# EAGLE design NB-IoT-ideaboard-v2.0 (EAGLE 8.7.1)

## Sheet 1 of 4
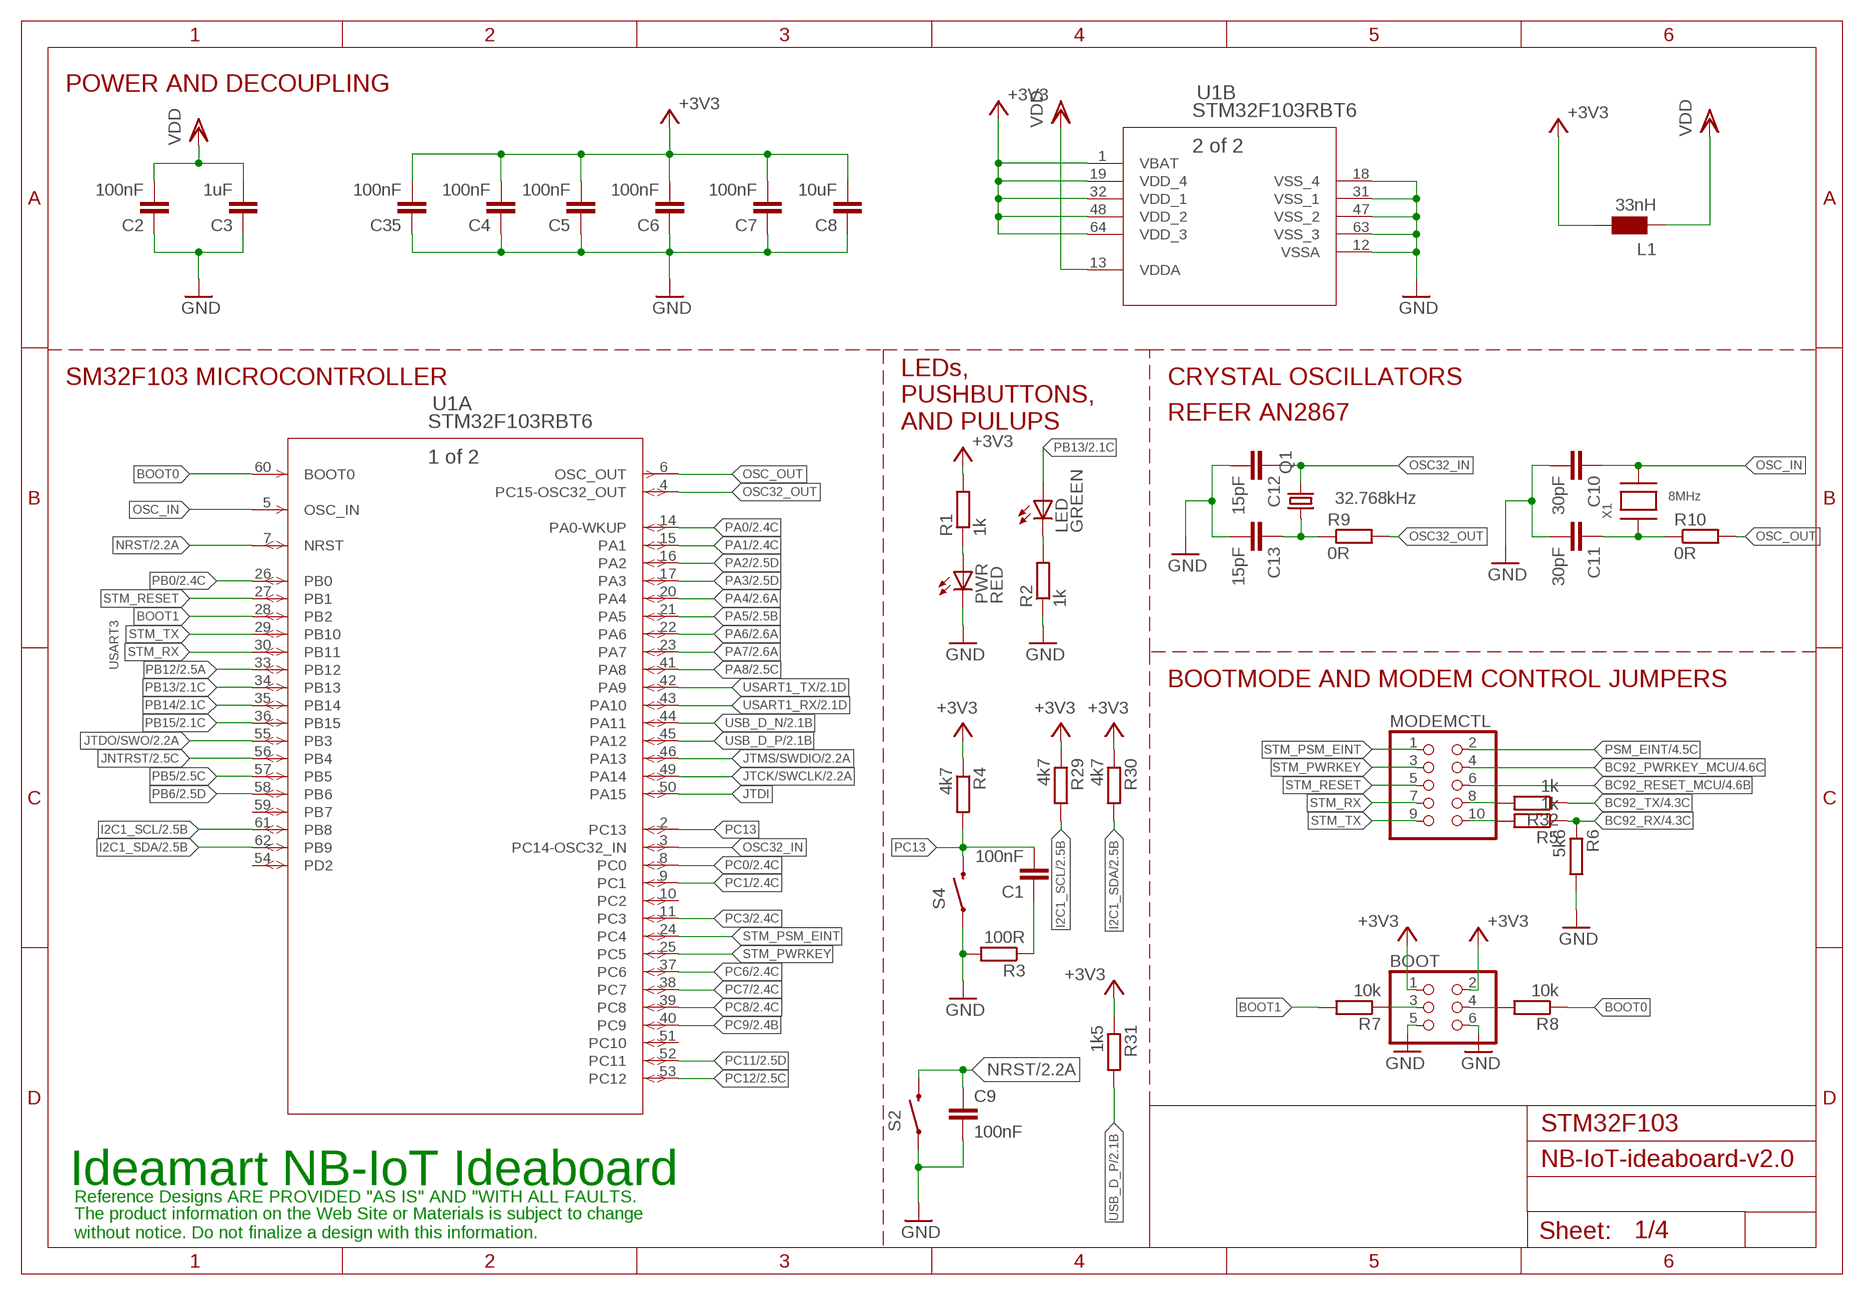
[diagram p0: schematic, sheet 1]

### Parts
BOOT  PINHD-2X03_2.54  [2X03]
C1  100nF  C-EUC0805  [C0805]
C2  100nF  C-EUC0805  [C0805]
C3  1uF  C-EUC0805  [C0805]
C4  100nF  C-EUC0805  [C0805]
C5  100nF  C-EUC0805  [C0805]
C6  100nF  C-EUC0805  [C0805]
C7  100nF  C-EUC0805  [C0805]
C8  10uF  C-EUC1206  [C1206]
C9  100nF  C-EUC0805  [C0805]
C10  30pF  C-EUC0805  [C0805]
C11  30pF  C-EUC0805  [C0805]
C12  15pF  C-EUC0805  [C0805]
C13  15pF  C-EUC0805  [C0805]
C35  100nF  C-EUC0805  [C0805]
L1  33nH  WE-CBF_0603  [0603]
LED  GREEN  LEDCHIP-LED0805  [CHIP-LED0805]
MODEMCTL  PINHD-2X05_2.54  [2X05]
PWR  RED  LEDCHIP-LED0805  [CHIP-LED0805]
Q1  32.768kHz  KX-327-NHT  [3.2X1.5]
R1  1k  R-EU_R0805  [R0805]
R2  1k  R-EU_R0805  [R0805]
R3  100R  R-EU_R0805  [R0805]
R4  4k7  R-EU_R0805  [R0805]
R5  1k  R-EU_R0805  [R0805]
R6  5k6  R-EU_R0805  [R0805]
R7  10k  R-EU_R0805  [R0805]
R8  10k  R-EU_R0805  [R0805]
R9  0R  R-EU_R0805  [R0805]
R10  0R  R-EU_R0805  [R0805]
R29  4k7  R-EU_R0805  [R0805]
R30  4k7  R-EU_R0805  [R0805]
R31  1k5  R-EU_R0805  [R0805]
R32  1k  R-EU_R0805  [R0805]
S2  SWITCH-MOMENTARY-2SMD  [TACTILE-SWITCH-SMD]
S4  SWITCH-MOMENTARY-2SMD  [TACTILE-SWITCH-SMD]
U1  STM32F103RBT6  [LQFP64-10X10MM]
X1  8MHz  XTALNX5032  [NX5032]

### Nets
+3V3: BOOT.1 BOOT.2 C4.2 C5.2 C6.2 C7.2 C8.2 C35.2 L1.2 R1.2 R4.1 R29.1 R30.1 R31.1 U1.1(B:VBAT) U1.19(B:VDD_4) U1.32(B:VDD_1) U1.48(B:VDD_2) U1.64(B:VDD_3) ; also sheet 2,3
BC92_PWRKEY_MCU: MODEMCTL.4 ; also sheet 4
BC92_RESET_MCU: MODEMCTL.6 ; also sheet 4
BC92_RX: R5.1 R6.1 ; also sheet 4
BC92_TX: R32.1 ; also sheet 4
BOOT0: R8.1 U1.60(A:BOOT0)
BOOT1: R7.2 U1.28(A:PB2)
GND [gnd]: BOOT.5 BOOT.6 C2.1 C3.1 C4.1 C5.1 C6.1 C7.1 C8.1 C9.2 C10.2 C11.2 C12.2 C13.2 C35.1 PWR.C R2.1 R3.2 R6.2 S2.1 S4.1 U1.12(B:VSSA) U1.18(B:VSS_4) U1.31(B:VSS_1) U1.47(B:VSS_2) U1.63(B:VSS_3) ; also sheet 2,3,4
I2C1_SCL: R29.2 U1.61(A:PB8) ; also sheet 2
I2C1_SDA: R30.2 U1.62(A:PB9) ; also sheet 2
JNTRST: U1.56(A:PB4) ; also sheet 2
JTCK/SWCLK: U1.49(A:PA14) ; also sheet 2
JTDI: U1.50(A:PA15)
JTDO/SWO: U1.55(A:PB3) ; also sheet 2
JTMS/SWDIO: U1.46(A:PA13) ; also sheet 2
N$1: BOOT.3 R7.1
N$3: PWR.A R1.1
N$7: C11.1 R10.1 X1.P$1
N$8: C13.1 Q1.1 R9.1
N$12: MODEMCTL.10 R5.2
N$17: MODEMCTL.8 R32.2
N$19: C1.1 R3.1
N$25: BOOT.4 R8.2
N$26: LED.C R2.2
NRST: C9.1 S2.3 U1.7(A:NRST) ; also sheet 2
OSC32_IN: C12.1 Q1.2 U1.3(A:PC14-OSC32_IN)
OSC32_OUT: R9.2 U1.4(A:PC15-OSC32_OUT)
OSC_IN: C10.1 U1.5(A:OSC_IN) X1.P$2
OSC_OUT: R10.2 U1.6(A:OSC_OUT)
PA0: U1.14(A:PA0-WKUP) ; also sheet 2
PA1: U1.15(A:PA1) ; also sheet 2
PA2: U1.16(A:PA2) ; also sheet 2
PA3: U1.17(A:PA3) ; also sheet 2
PA4: U1.20(A:PA4) ; also sheet 2
PA5: U1.21(A:PA5) ; also sheet 2
PA6: U1.22(A:PA6) ; also sheet 2
PA7: U1.23(A:PA7) ; also sheet 2
PA8: U1.41(A:PA8) ; also sheet 2
PB0: U1.26(A:PB0) ; also sheet 2
PB5: U1.57(A:PB5) ; also sheet 2
PB6: U1.58(A:PB6) ; also sheet 2
PB12: U1.33(A:PB12) ; also sheet 2
PB13: LED.A U1.34(A:PB13) ; also sheet 2
PB14: U1.35(A:PB14) ; also sheet 2
PB15: U1.36(A:PB15) ; also sheet 2
PC0: U1.8(A:PC0) ; also sheet 2
PC1: U1.9(A:PC1) ; also sheet 2
PC3: U1.11(A:PC3) ; also sheet 2
PC6: U1.37(A:PC6) ; also sheet 2
PC7: U1.38(A:PC7) ; also sheet 2
PC8: U1.39(A:PC8) ; also sheet 2
PC9: U1.40(A:PC9) ; also sheet 2
PC11: U1.52(A:PC11) ; also sheet 2
PC12: U1.53(A:PC12) ; also sheet 2
PC13: C1.2 R4.2 S4.3 U1.2(A:PC13)
PSM_EINT: MODEMCTL.2 ; also sheet 4
STM_PSM_EINT: MODEMCTL.1 U1.24(A:PC4)
STM_PWRKEY: MODEMCTL.3 U1.25(A:PC5)
STM_RESET: MODEMCTL.5 U1.27(A:PB1)
STM_RX: MODEMCTL.7 U1.30(A:PB11)
STM_TX: MODEMCTL.9 U1.29(A:PB10)
USART1_RX: U1.43(A:PA10) ; also sheet 2
USART1_TX: U1.42(A:PA9) ; also sheet 2
USB_D_N [usb_diff]: U1.44(A:PA11) ; also sheet 2,3
USB_D_P [usb_diff]: R31.2 U1.45(A:PA12) ; also sheet 2,3
VDD: C2.2 C3.2 L1.1 U1.13(B:VDDA)
Unconnected: U1.10(A:PC2) U1.51(A:PC10) U1.54(A:PD2) U1.59(A:PB7)

### Notes on the sheet
- POWER AND DECOUPLING
- SM32F103 MICROCONTROLLER | CRYSTAL OSCILLATORS
- REFER AN2867
- LEDs,
  PUSHBUTTONS,
  AND PULUPS
- USART3
- BOOTMODE AND MODEM CONTROL JUMPERS
- STM32F103
- Ideamart NB-IoT Ideaboard
- Reference Designs ARE PROVIDED "AS IS" AND "WITH ALL FAULTS.
- The product information on the Web Site or Materials is subject to change
  without notice. Do not finalize a design with this information.

## Sheet 2 of 4
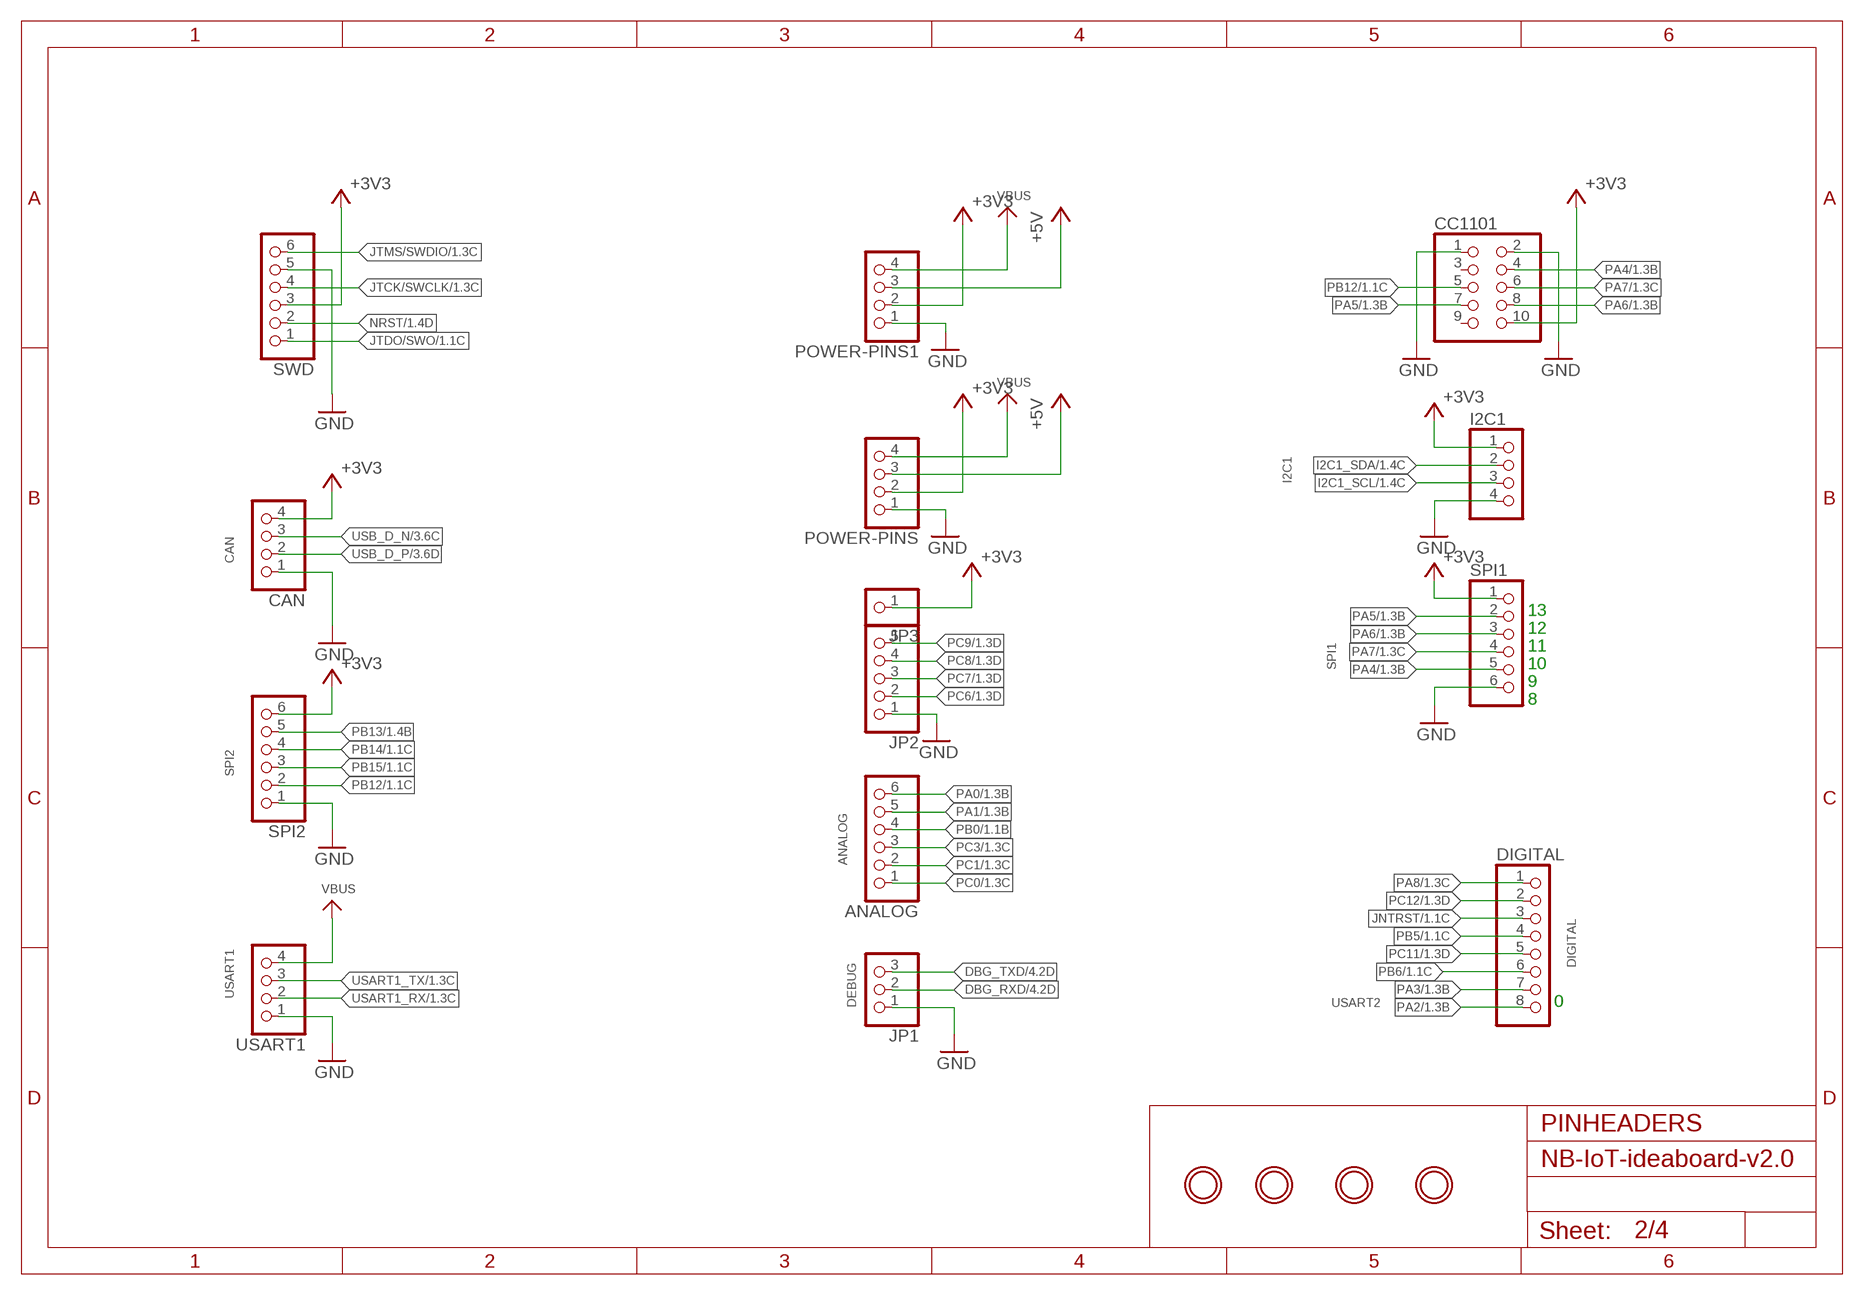
[diagram p1: schematic, sheet 2]

### Parts
$H1  MOUNTINGHOLE3.0THIN  [MOUNTINGHOLE_3.0_PLATEDTHIN]
$H2  MOUNTINGHOLE3.0THIN  [MOUNTINGHOLE_3.0_PLATEDTHIN]
$H3  MOUNTINGHOLE3.0THIN  [MOUNTINGHOLE_3.0_PLATEDTHIN]
$H4  MOUNTINGHOLE3.0THIN  [MOUNTINGHOLE_3.0_PLATEDTHIN]
ANALOG  PINHD-1X06_2.54-S  [1X06-S]
CAN  PINHD-1X04_2.54-S  [1X04-S]
CC1101  PINHD-2X05_2.54  [2X05]
DIGITAL  PINHD-1X08_2.54-S  [1X08-S]
I2C1  PINHD-1X04_2.54-S  [1X04-S]
JP1  PINHD-1X03_2.54-S  [1X03-S]
JP2  PINHD-1X05_2.54-S  [1X05-S]
JP3  PINHD-1X01_2.54-S  [1X01-S]
POWER-PINS  PINHD-1X04_2.54-S  [1X04-S]
POWER-PINS1  PINHD-1X04_2.54-S  [1X04-S]
SPI1  PINHD-1X06_2.54-S  [1X06-S]
SPI2  PINHD-1X06_2.54-S  [1X06-S]
SWD  PINHD-1X06_2.54-S  [1X06-S]
USART1  PINHD-1X04_2.54-S  [1X04-S]

### Nets
+3V3: CAN.4 CC1101.10 I2C1.1 JP3.1 POWER-PINS1.2 POWER-PINS.2 SPI1.1 SPI2.6 SWD.3 ; also sheet 1,3
+5V [usbvcc]: POWER-PINS1.3 POWER-PINS.3 ; also sheet 3
DBG_RXD: JP1.2 ; also sheet 4
DBG_TXD: JP1.3 ; also sheet 4
GND [gnd]: CAN.1 CC1101.1 CC1101.2 I2C1.4 JP1.1 JP2.1 POWER-PINS1.1 POWER-PINS.1 SPI1.6 SPI2.1 SWD.5 USART1.1 ; also sheet 1,3,4
I2C1_SCL: I2C1.3 ; also sheet 1
I2C1_SDA: I2C1.2 ; also sheet 1
JNTRST: DIGITAL.3 ; also sheet 1
JTCK/SWCLK: SWD.4 ; also sheet 1
JTDO/SWO: SWD.1 ; also sheet 1
JTMS/SWDIO: SWD.6 ; also sheet 1
NRST: SWD.2 ; also sheet 1
PA0: ANALOG.6 ; also sheet 1
PA1: ANALOG.5 ; also sheet 1
PA2: DIGITAL.8 ; also sheet 1
PA3: DIGITAL.7 ; also sheet 1
PA4: CC1101.4 SPI1.5 ; also sheet 1
PA5: CC1101.7 SPI1.2 ; also sheet 1
PA6: CC1101.8 SPI1.3 ; also sheet 1
PA7: CC1101.6 SPI1.4 ; also sheet 1
PA8: DIGITAL.1 ; also sheet 1
PB0: ANALOG.4 ; also sheet 1
PB5: DIGITAL.4 ; also sheet 1
PB6: DIGITAL.6 ; also sheet 1
PB12: CC1101.5 SPI2.2 ; also sheet 1
PB13: SPI2.5 ; also sheet 1
PB14: SPI2.4 ; also sheet 1
PB15: SPI2.3 ; also sheet 1
PC0: ANALOG.1 ; also sheet 1
PC1: ANALOG.2 ; also sheet 1
PC3: ANALOG.3 ; also sheet 1
PC6: JP2.2 ; also sheet 1
PC7: JP2.3 ; also sheet 1
PC8: JP2.4 ; also sheet 1
PC9: JP2.5 ; also sheet 1
PC11: DIGITAL.5 ; also sheet 1
PC12: DIGITAL.2 ; also sheet 1
USART1_RX: USART1.2 ; also sheet 1
USART1_TX: USART1.3 ; also sheet 1
USB_D_N [usb_diff]: CAN.3 ; also sheet 1,3
USB_D_P [usb_diff]: CAN.2 ; also sheet 1,3
VBUS [usbvcc]: POWER-PINS1.4 POWER-PINS.4 USART1.4 ; also sheet 3
Unconnected: CC1101.3 CC1101.9

### Notes on the sheet
- I2C1
- CAN
- 13
- 12
- 11
- SPI1 | 10
- 9
- 8
- SPI2
- ANALOG
- DIGITAL
- USART1 | USART2
- DEBUG | 0
- PINHEADERS

## Sheet 3 of 4
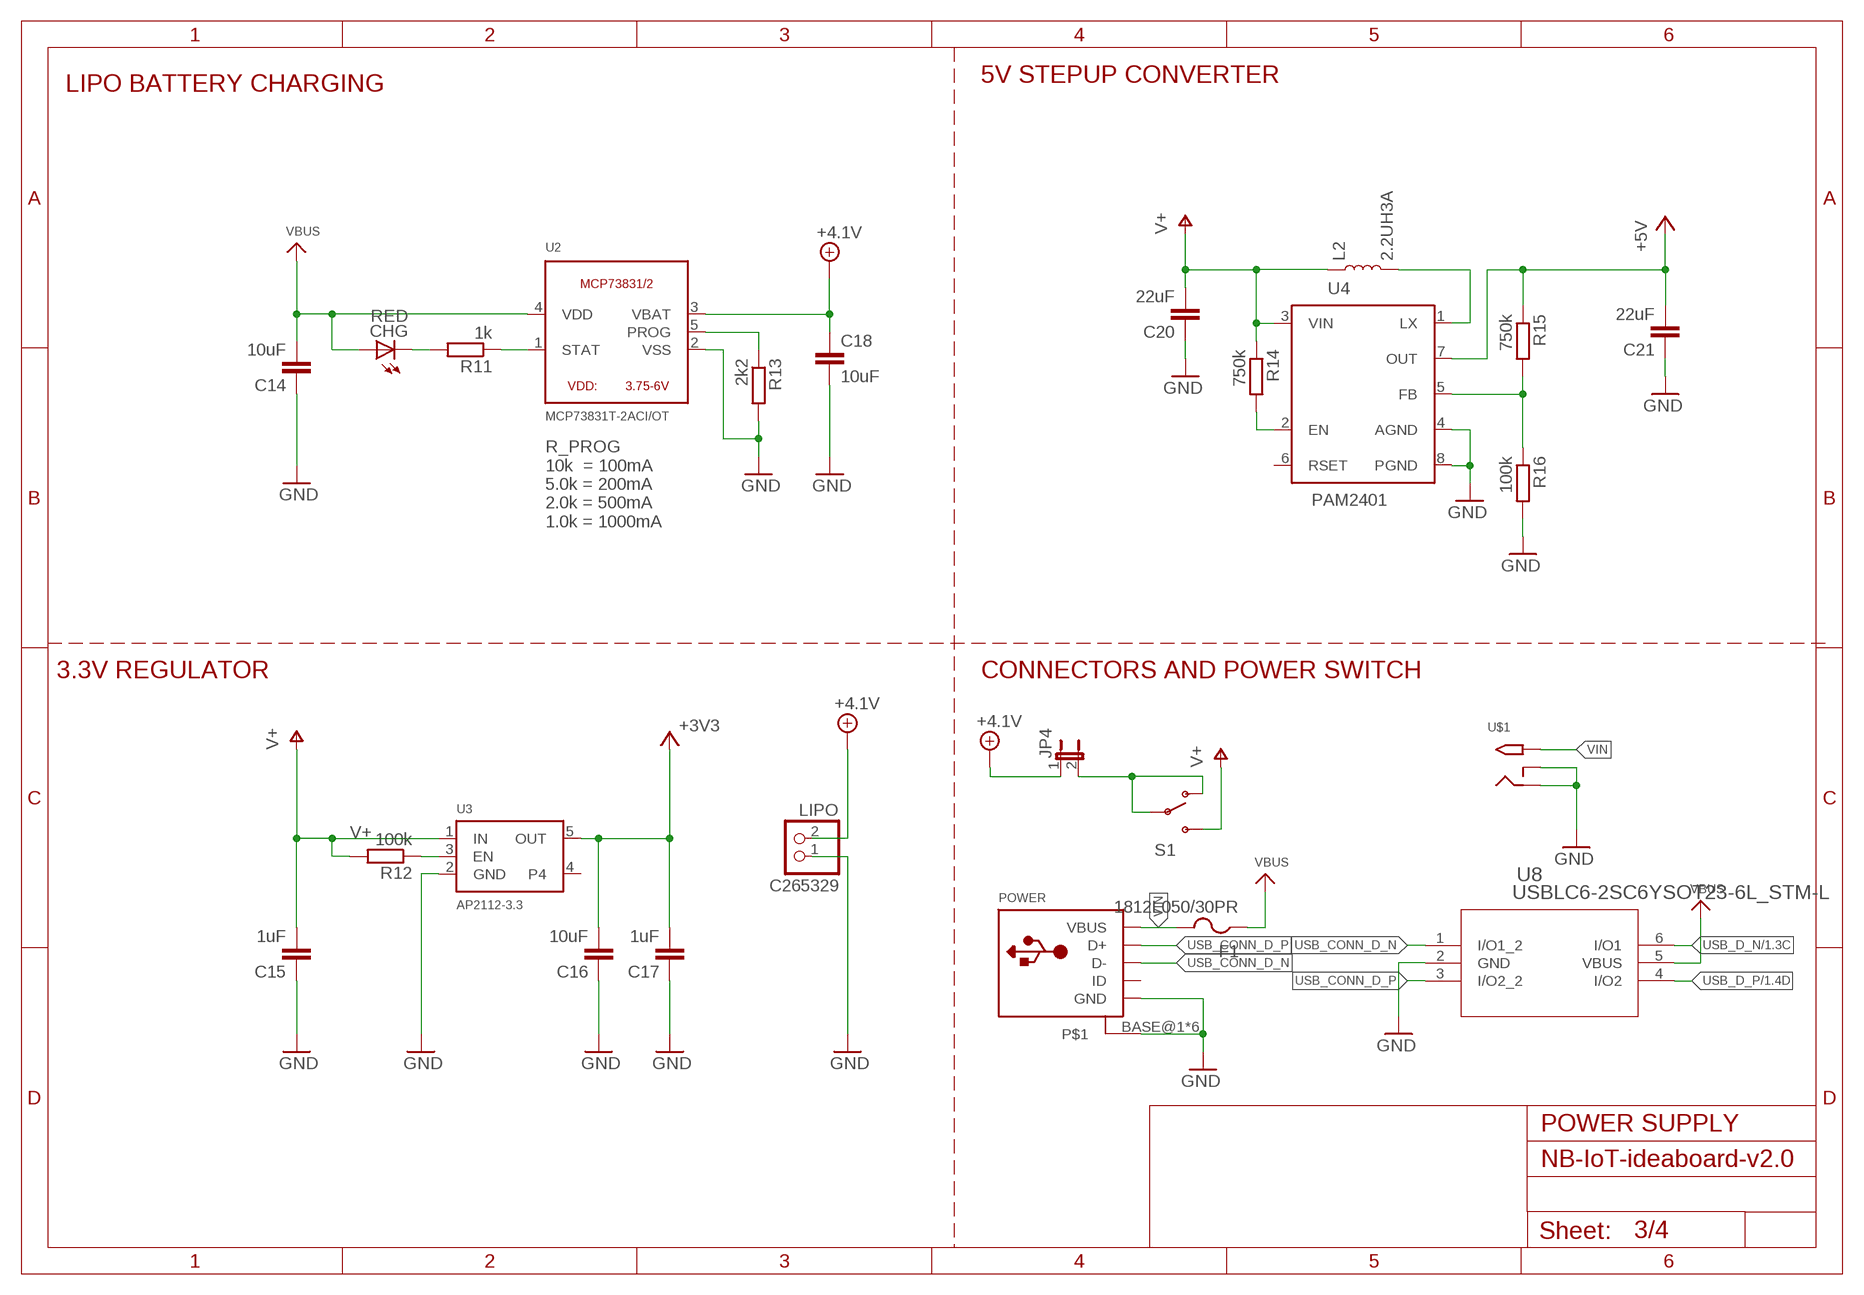
[diagram p2: schematic, sheet 3]

### Parts
C14  10uF  C-EUC0805  [C0805]
C15  1uF  C-EUC0805  [C0805]
C16  10uF  C-EUC0805  [C0805]
C17  1uF  C-EUC0805  [C0805]
C18  10uF  C-EUC0805  [C0805]
C20  22uF  C-EUC0805  [C0805]
C21  22uF  C-EUC0805  [C0805]
CHG  RED  LEDCHIP-LED0805  [CHIP-LED0805]
F1  1812L050/30PR  PTCFUSE-1812  [1812]
JP4  JP1E  [JP1]
L2  2.2UH3A  INDUCTOR-IFSC1515AHER2R2M01  [INDUCTOR_4X4MM]
LIPO  C265329  JST_2PIN-SMT  [JST-PH-2-SMT]
POWER  USB_MICRO_20329_V2  [4UCONN_20329_V2]
R11  1k  R-EU_R0805  [R0805]
R12  100k  R-EU_R0805  [R0805]
R13  2k2  R-EU_R0805  [R0805]
R14  750k  R-EU_R0805  [R0805]
R15  750k  R-EU_R0805  [R0805]
R16  100k  R-EU_R0805  [R0805]
S1  SWITCH-SPDT-SMD-A  [SWITCH-SPST-SMD-A]
U2  MCP73831T-2ACI/OT  MCP73831/2  [SOT23-5]
U3  AP2112-3.3  VREG_SOT23-5  [SOT23-5]
U4  PAM2401  [MSOP8]
U8  USBLC6-2SC6YSOT23-6L_STM-L  [SOT23-6L_STM-L]
U$1  2.1MMJACKSMT  [DCJACK_2MM_SMT]

### Nets
+3V3: C16.2 C17.2 U3.5(OUT) ; also sheet 1,2
+4.1V: C18.1 JP4.1 LIPO.2 U2.3(VBAT)
+5V [usbvcc]: C21.2 R15.1 U4.7(OUT) ; also sheet 2
EN: R14.2 U4.2(EN)
GND [gnd]: C14.1 C15.1 C16.1 C17.1 C18.2 C20.1 C21.1 LIPO.1 POWER.BASE@1 POWER.BASE@2 POWER.GND POWER.SPRT@1 POWER.SPRT@2 POWER.SPRT@3 POWER.SPRT@4 R13.2 R16.2 U2.2(VSS) U3.2(GND) U4.4(AGND) U4.8(PGND) U8.2(GND) U$1.GND(RING) U$1.GNDBREAK(RING_SW) ; also sheet 1,2,4
N$5: R12.1 U3.3(EN)
N$9: CHG.C R11.2
N$11: R11.1 U2.1(STAT)
N$20: R13.1 U2.5(PROG)
N$21: R15.2 R16.1 U4.5(FB)
N$22: L2.P$2 U4.1(LX)
N$24: JP4.2 S1.1(O) S1.2(P)
USB_CONN_D_N [usb_diff]: POWER.D- U8.1(I/O1_2)
USB_CONN_D_P [usb_diff]: POWER.D+ U8.3(I/O2_2)
USB_D_N [usb_diff]: U8.6(I/O1) ; also sheet 1,2
USB_D_P [usb_diff]: U8.4(I/O2) ; also sheet 1,2
V+: C15.2 C20.2 L2.P$1 R12.2 R14.1 S1.3(S) U3.1(IN) U4.3(VIN) ; also sheet 4
VBUS [usbvcc]: C14.2 CHG.A F1.1 U2.4(VDD) U8.5(VBUS) ; also sheet 2
VIN [usbvcc]: F1.2 POWER.VBUS U$1.PWR2(TIP)
Unconnected: POWER.ID U3.4 U4.6(RSET)

### Notes on the sheet
- 5V STEPUP CONVERTER
- LIPO BATTERY CHARGING
- R_PROG
  10k  = 100mA
  5.0k = 200mA
  2.0k = 500mA
  1.0k = 1000mA
- 3.3V REGULATOR | CONNECTORS AND POWER SWITCH
- POWER SUPPLY

## Sheet 4 of 4
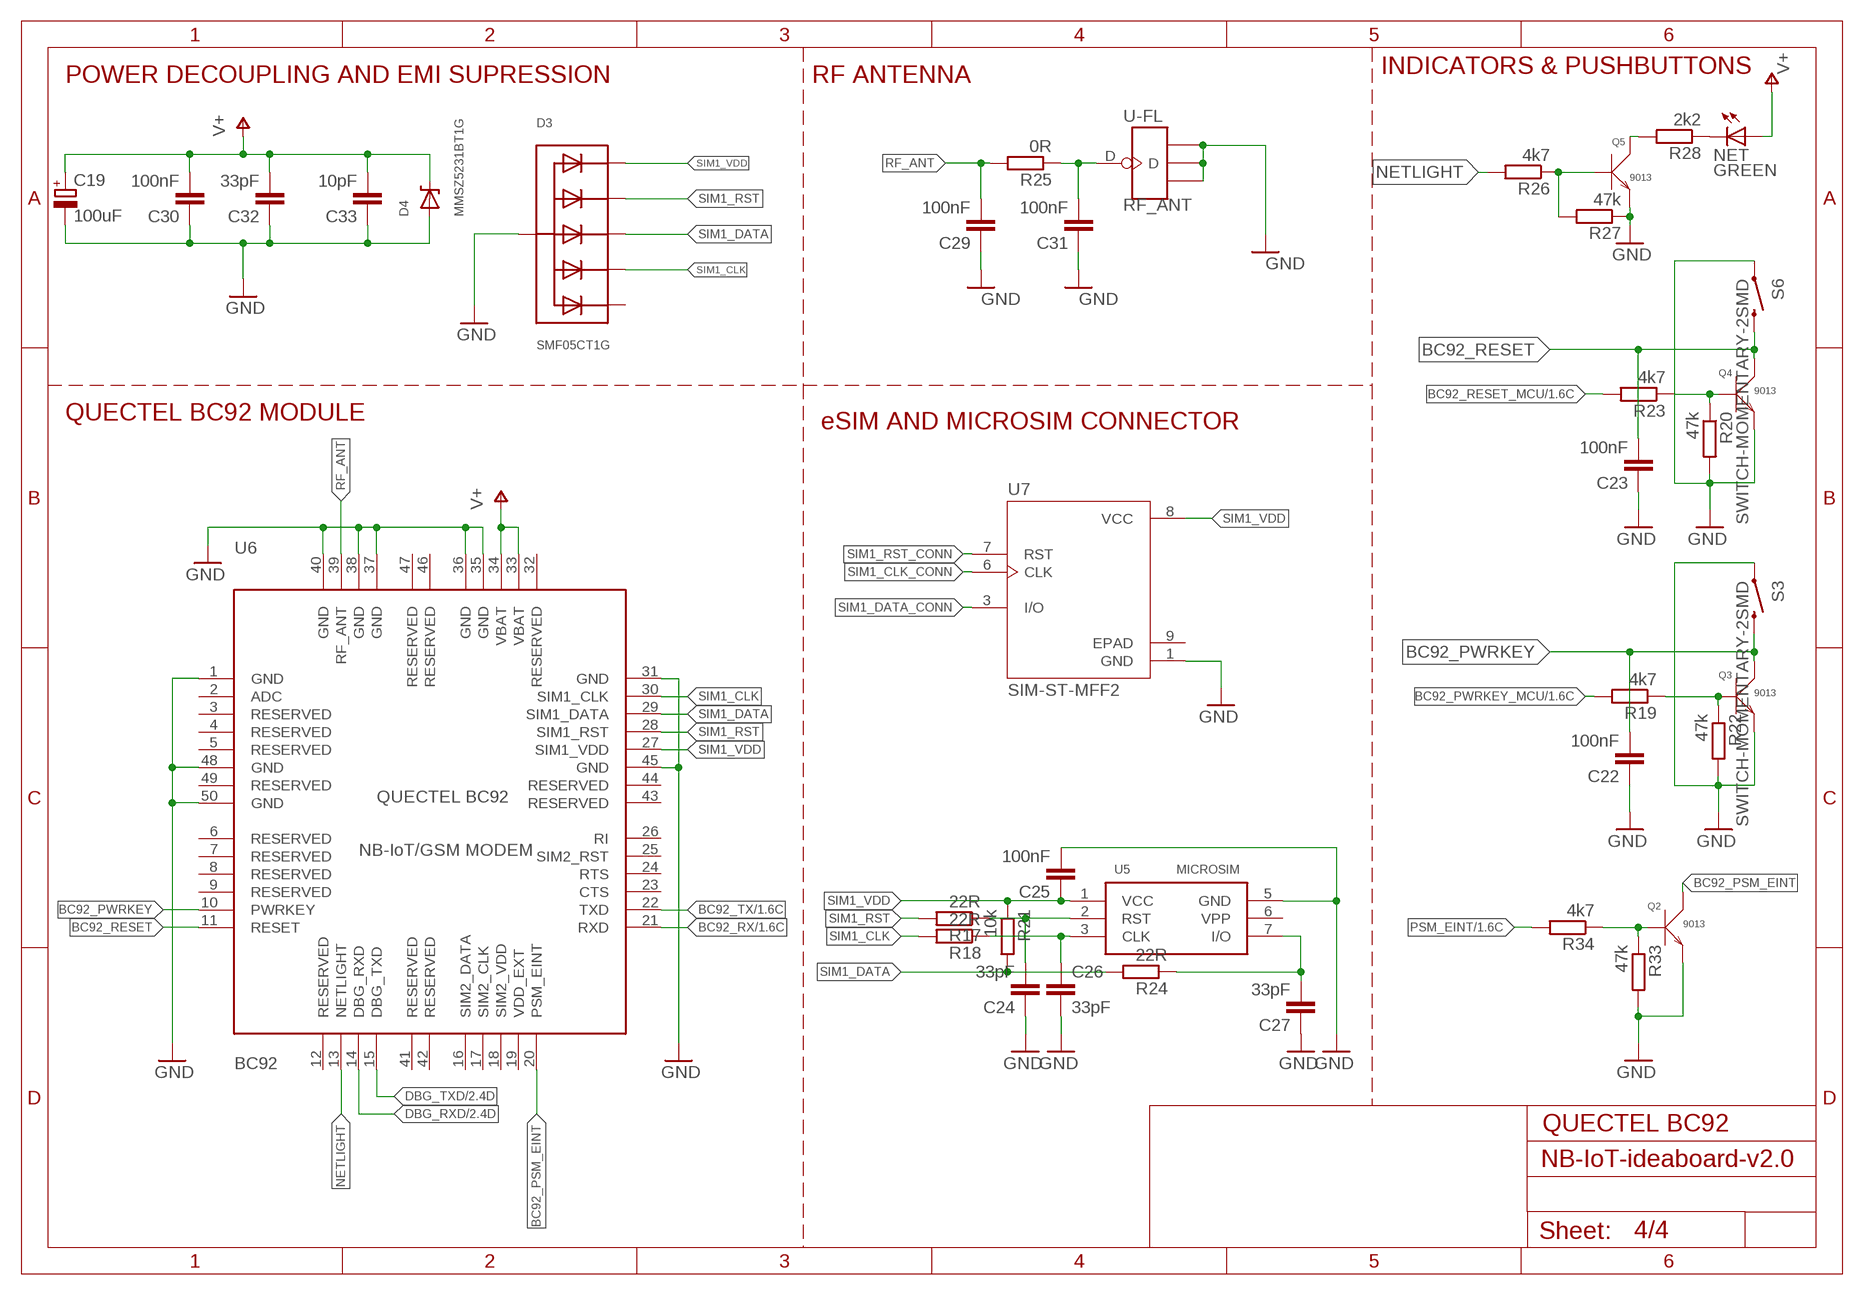
[diagram p3: schematic, sheet 4]

### Parts
C19  100uF  CPOL-EUB/3528-21R  [B/3528-21R]
C22  100nF  C-EUC0805  [C0805]
C23  100nF  C-EUC0805  [C0805]
C24  33pF  C-EUC0805  [C0805]
C25  100nF  C-EUC0805  [C0805]
C26  33pF  C-EUC0805  [C0805]
C27  33pF  C-EUC0805  [C0805]
C29  100nF  C-EUC0805  [C0805]
C30  100nF  C-EUC0805  [C0805]
C31  100nF  C-EUC0805  [C0805]
C32  33pF  C-EUC0805  [C0805]
C33  10pF  C-EUC0805  [C0805]
D3  SMF05CT1G  TVSARRAY_5LANE  [SOT363]
D4  MMSZ5231BT1G  DIODE-ZENERSOD123  [SOD-123]
NET  GREEN  LEDCHIP-LED0805  [CHIP-LED0805]
Q2  9013  TRANSISTOR-NPN-SOT23  [SOT23]
Q3  9013  TRANSISTOR-NPN-SOT23  [SOT23]
Q4  9013  TRANSISTOR-NPN-SOT23  [SOT23]
Q5  9013  TRANSISTOR-NPN-SOT23  [SOT23]
R17  22R  R-EU_R0805  [R0805]
R18  22R  R-EU_R0805  [R0805]
R19  4k7  R-EU_R0805  [R0805]
R20  47k  R-EU_R0805  [R0805]
R21  10k  R-EU_R0805  [R0805]
R22  47k  R-EU_R0805  [R0805]
R23  4k7  R-EU_R0805  [R0805]
R24  22R  R-EU_R0805  [R0805]
R25  0R  R-EU_R0805  [R0805]
R26  4k7  R-EU_R0805  [R0805]
R27  47k  R-EU_R0805  [R0805]
R28  2k2  R-EU_R0805  [R0805]
R33  47k  R-EU_R0805  [R0805]
R34  4k7  R-EU_R0805  [R0805]
RF_ANT  U-FL  ANTENNA-U-FL  [4P-U-FL]
S3  SWITCH-MOMENTARY-2SMD  [TACTILE-SWITCH-SMD]
S6  SWITCH-MOMENTARY-2SMD  [TACTILE-SWITCH-SMD]
U5  MICROSIM  [MICROSIM]
U6  BC92  [BC92]
U7  SIM-ST-MFF2  [PSON127P500X600X82-9N]

### Nets
BC92_PSM_EINT: Q2.3(C) U6.20(PSM_EINT)
BC92_PWRKEY: C22.2 Q3.3(C) S3.3 U6.10(PWRKEY)
BC92_PWRKEY_MCU: R19.2 ; also sheet 1
BC92_RESET: C23.2 Q4.3(C) S6.3 U6.11(RESET)
BC92_RESET_MCU: R23.2 ; also sheet 1
BC92_RX: U6.21(RXD) ; also sheet 1
BC92_TX: U6.22(TXD) ; also sheet 1
DBG_RXD: U6.14(DBG_RXD) ; also sheet 2
DBG_TXD: U6.15(DBG_TXD) ; also sheet 2
GND [gnd]: C19.- C22.1 C23.1 C24.1 C25.2 C26.2 C27.1 C29.1 C30.1 C31.1 C32.1 C33.1 D3.2(A) D4.A Q2.2(E) Q3.2(E) Q4.2(E) Q5.2(E) R20.2 R22.2 R27.1 R33.2 RF_ANT.GND1 RF_ANT.GND2 RF_ANT.GND3 S3.1 S6.1 U5.5(GND) U6.1(GND) U6.31(GND) U6.35(GND) U6.36(GND) U6.37(GND) U6.38(GND) U6.40(GND) U6.45(GND) U6.48(GND) U6.50(GND) U7.1(GND) ; also sheet 1,2,3
N$2: Q3.1(B) R19.1 R22.1
N$4: Q4.1(B) R20.1 R23.1
N$6 [antenna]: C31.2 R25.1 RF_ANT.D
N$10: NET.C R28.1
N$16: Q5.3(C) R28.2
N$18: Q5.1(B) R26.1 R27.2
N$23: Q2.1(B) R33.1 R34.1
NETLIGHT: R26.2 U6.13(NETLIGHT)
PSM_EINT: R34.2 ; also sheet 1
RF_ANT [antenna]: C29.2 R25.2 U6.39(RF_ANT)
SIM1_CLK: D3.5(C4) R18.2 U6.30(SIM1_CLK)
SIM1_CLK_CONN: C26.1 R18.1 U5.3(CLK) U7.6(CLK)
SIM1_DATA: D3.4(C3) R21.2 R24.2 U6.29(SIM1_DATA)
SIM1_DATA_CONN: C27.2 R24.1 U5.7(I/O) U7.3(I/O)
SIM1_RST: D3.3(C2) R17.2 U6.28(SIM1_RST)
SIM1_RST_CONN: C24.2 R17.1 U5.2(RST) U7.7(RST)
SIM1_VDD: C25.1 D3.1(C1) R21.1 U5.1(VCC) U6.27(SIM1_VDD) U7.8(VCC)
V+: C19.+ C30.2 C32.2 C33.2 D4.C NET.A U6.33(VBAT) U6.34(VBAT) ; also sheet 3
Unconnected: D3.6(C5) U5.6(VPP) U6.2(ADC) U6.3(RESERVED) U6.4(RESERVED) U6.5(RESERVED) U6.6(RESERVED) U6.7(RESERVED) U6.8(RESERVED) U6.9(RESERVED) U6.12(RESERVED) U6.16(SIM2_DATA) U6.17(SIM2_CLK) U6.18(SIM2_VDD) U6.19(VDD_EXT) U6.23(CTS) U6.24(RTS) U6.25(SIM2_RST) U6.26(RI) U6.32(RESERVED) U6.41(RESERVED) U6.42(RESERVED) U6.43(RESERVED) U6.44(RESERVED) U6.46(RESERVED) U6.47(RESERVED) U6.49(RESERVED) U7.9(EPAD)

### Notes on the sheet
- INDICATORS & PUSHBUTTONS
- POWER DECOUPLING AND EMI SUPRESSION | RF ANTENNA
- QUECTEL BC92 MODULE
- eSIM AND MICROSIM CONNECTOR
- QUECTEL BC92

## Library data of the parts
$H1-$H4 = Adafruit SIM808 Breakout:MOUNTINGHOLE: Mounting Hole For #2 screws (0.086"/2.18mm width, 0.094"/2.4mm hole) use 2.5mm; BOM: EXCLUDE
ANALOG SPI1 SPI2 SWD = pinhead-2:PINHD-1X06: PIN HEADER
BOOT = pinhead-2:PINHD-2X03: PIN HEADER
C1-C18 C20-C27 C29-C33 C35 = rcl:C-EU: CAPACITOR, European symbol; SPICEPREFIX: C
C19 = rcl:CPOL-EU: POLARIZED CAPACITOR, European symbol; SPICEPREFIX: C
CAN I2C1 POWER-PINS POWER-PINS1 USART1 = pinhead-2:PINHD-1X04: PIN HEADER
CC1101 MODEMCTL = pinhead-2:PINHD-2X05: PIN HEADER
CHG LED NET PWR = led:LED: LED OSRAM: - CHIPLED LG R971, LG N971, LY N971, LG Q971, LY Q971, LO R971, LY R971 LH N974, LH R974 LS Q976, LO Q976, LY Q976 LO Q996 - Hyper CHIPLED LW Q18S LB Q993, LB Q99A, LB R99A - SideLED LS A670, LO A670, LY A670, LG A670, LP A670 LB A673, LV A673, LT A673, LW A673 LH A674 LY A675 LS A676, LA A676, LO A676, LY A676, LW A676 LS A679, LY A679, LG A679 - Hyper Micro SIDELED® LS Y876, LA Y876, LO Y876, LY Y876 LT Y87S - SmartLED LW L88C, LW L88S LB L89C, LB L89S, LG L890 LS L89K, LO L89K, LY L89K LS L896, LA L896, LO L896, LY L896 - TOPLED LS T670, LO T670, LY T670, LG T670, LP T670 LSG T670, LSP T670, LSY T670, LOP T670, LYG T670 LG T671, LOG T671, LSG T671 LB T673, LV T673, LT T673, LW T673 LH T674 LS T676, LA T676, LO T676, LY T676, LB T676, LH T676, LSB T676, LW T676 LB T67C, LV T67C, LT T67C, LS T67K, LO T67K, LY T67K, LW E67C LS E67B, LA E67B, LO E67B, LY E67B, LB E67C, LV E67C, LT E67C LW T67C LS T679, LY T679, LG T679 LS T770, LO T770, LY T770, LG T770, LP T770 LB T773, LV T773, LT T773, LW T773 LH T774 LS E675, LA E675, LY E675, LS T675 LS T776, LA T776, LO T776, LY T776, LB T776 LHGB T686 LT T68C, LB T68C - Hyper Mini TOPLED® LB M676 - Mini TOPLED Santana® LG M470 LS M47K, LO M47K, LY M47K Source: http://www.osram.convergy.de LUXEON: - LUMILED® LXK2-PW12-R00, LXK2-PW12-S00, LXK2-PW14-U00, LXK2-PW14-V00 LXK2-PM12-R00, LXK2-PM12-S00, LXK2-PM14-U00 LXK2-PE12-Q00, LXK2-PE12-R00, LXK2-PE12-S00, LXK2-PE14-T00, LXK2-PE14-U00 LXK2-PB12-K00, LXK2-PB12-L00, LXK2-PB12-M00, LXK2-PB14-N00, LXK2-PB14-P00, LXK2-PB14-Q00 LXK2-PR12-L00, LXK2-PR12-M00, LXK2-PR14-Q00, LXK2-PR14-R00 LXK2-PD12-Q00, LXK2-PD12-R00, LXK2-PD12-S00 LXK2-PH12-R00, LXK2-PH12-S00 LXK2-PL12-P00, LXK2-PL12-Q00, LXK2-PL12-R00 Source: www.luxeon.com KINGBRIGHT: KA-3528ASYC Source: www.kingbright.com
D3 = Adafruit SIM808 Breakout:TVSARRAY_5LANE: Voltage Transient Suppressor Array SOT363 SMF05C - 100W 5V: Digikey - SMF05CT1GOSCT-ND
D4 = Adafruit SIM808 Breakout:DIODE-ZENER: Zener Diode SMA: 30V 1W Zener Diode, 1.2Vf - Digikey: SMAZ30-FDICT-ND
DIGITAL = pinhead-2:PINHD-1X08: PIN HEADER
F1 = adafruit:PTCFUSE: PTC fuses, resettable thermistors
JP1 = pinhead-2:PINHD-1X03: PIN HEADER
JP2 = pinhead-2:PINHD-1X05: PIN HEADER
JP3 = pinhead-2:PINHD-1X01: PIN HEADER
JP4 = jumper:JP1E: JUMPER
L1 = wuerth-elektronik:WE-CBF: SMD EMI Suppression Ferrite Beads - excellent anti-EMI properties - low DCR - impedances till 3000 ohms - rated current up to 6 A
L2 = SparkFun-Coils:INDUCTOR: Inductors Resist changes in electrical current. Basically a coil of wire. SparkFun Products: SparkFun Load Cell Amplifier - HX711 <https://www.sparkfun.com/products/13879> IOIO-OTG - V2.2 <https://www.sparkfun.com/products/13613>; PROD_ID: NDUC-13770
LIPO = adafruit:JST_2PIN: JST 2-Pin Connectors of various flavors SMT-RA (S2B-PH-SM4) 4UConnector #17311 SMT (B2B-PH-SM4) THM-RA (S2B-PH) THM (B2B-PH)
POWER = Adafruit SIM808 Breakout:USB: USB Connectors USBMINIB - Surface Mount Female Mini-B USB Connector 4UConnector: 06564
Q1 = crystal-geyer_V1_0:KX-327: Tuning Fork Crystals (kHz) SMD: KX327 - Serie Model Size l/w/h [mm] Frequency Range Frequency Stability Temp. Range [°C] Load Capacitance AECQ 200 availabel Datasheet KX-327VT KX-327FT KX-327RT KX-327NHT KX-327NHF KX-327L KX-327S 1.25/1.05/0.5 1.6/1.0/0.5 2.0/1.2/0.6 3.2/1.5/0.8 3.2/1.5/0.8 7.0/1.5/1.4 8.2/3.8/2.5 32,768 kHz 32,768 kHz 32,768 kHz 32,768 kHz 32,768 kHz 32,768 kHz 32,768 kHz ±10 … ±20ppm ±10 … ±20ppm ±10 … ±20ppm ±10 … ±20ppm ±10 … ±20ppm ±10 … ±20ppm ±5 … ±20ppm (*) -40°C …+85°C (*) -40°C …+85°C (*) -40°C …+85°C (*) -40°C …+85°C (*) -40°C …+125°C (*) -40°C …+85°C (*) -40°C …+85°C 7/9/12,5 7/9/12,5 7/9/12,6 7/9/12,5 9/12,5 7/9/12,5 6/12,5 - - - - yes - - KX-327VT.pdf <http://www.geyer-electronic.de/uploads/tx_userartikelfrequenz/GEYER-KX-327VT.pdf> KX-327FT.pdf <http://www.geyer-electronic.de/uploads/tx_userartikelfrequenz/GEYER-KX-327FT.pdf> KX-327RT.pdf <http://www.geyer-electronic.de/uploads/tx_userartikelfrequenz/GEYER-KX-327RT.pdf> KX-327NHT.pdf <http://www.geyer-electronic.de/uploads/tx_userartikelfrequenz/GEYER-KX-327NHT.pdf> KX-327NHF.pdf <http://www.geyer-electronic.de/uploads/tx_userartikelfrequenz/GEYER-KX-327NHF.pdf> KX-327L.pdf <http://www.geyer-electronic.de/uploads/tx_userartikelfrequenz/GEYER-KX-327L.pdf> KX-327S.pdf <http://www.geyer-electronic.de/uploads/tx_userartikelfrequenz/GEYER-KX-327S.pdf> <http://www.geyer-electronic.de/fileadmin/template/img/logo-geyer-electronic.png> Details see: http://www.geyer-electronic.de/Frequenz-Produkte.9.0.html Created 2016-06-07, Hans Locher 2016 (C) Geyer Quartz Technology KX327VT,KX327FT,KX327RT,KX327NHT,KX327NHF,KX327S,KX327L;125105;1610;2012;3215;7015;8238;1,25x1,05,1.25x1.05;1,6x1,0,1.6x1.0;2,0x1,2,2.0x1.2;3,2x1,5,3.2x1.5;8,2x3,8,8.2x3.8,7.0x1.5,7,0x1,532.768kHz
Q2-Q5 = discrete:TRANSISTOR-NPN*: NPN audion
R1-R34 = rcl:R-EU_: RESISTOR, European symbol; SPICEPREFIX: R
RF_ANT = Connector:ANTENNA-U-FL
S1 = SparkFun-Electromechanical:SWITCH-SPDT: SPDT Switch Simple slide switch, Spark Fun Electronics SKU : COM-00102 DPDT SMT slide switch, AYZ0202, SWCH-08179; PROD_ID: SWCH-10651
S2-S4 S6 = SparkFun-Electromechanical:SWITCH-MOMENTARY-2: Various NO switches- pushbuttons, reed, etc; PROD_ID: SWCH-08247
U1 = STM32F103RBT6:STM32F103RBT6; BUILT_BY: EMA_UL_Team; COPYRIGHT: Copyright (C) 2018 Accelerated Designs. All rights reserved; MANUFACTURER_PART_NUMBER: STM32F103RBT6; SOURCELIBRARY: Updates_to_database_2020-10-19; VENDOR: STMicroelectronics
U2 = MCP73831:MCP73831/2: MCP73831/2 LIPO Charger VDD: 3.75 - 6V Temp -40 - 85°C Programmable Charge Rate: 15-500mA NOTE: STAT is a tri-state logic output on the MCP73831 and an open-drain output on the MCP73832. SOT23-5 with 4.2V output and tri-state logic on STAT = MCP73831T-2ACI/OT
U3 = AP2112 3.3 Reg:VREG_SOT23-5: SOT23-5 Fixed Voltage Regulators Part Current Out V Out V In V Dropout ?JA (°C/W) TJ (°C) Digikey Part No. ADP121 150mA 3.3V 3.4-5.5V 0.09V @ 150mA -- -- ADP121-AUJZ33R7CT-ND ADP121 150mA 3.0V 3.1-5.5V 0.09V @ 150mA -- -- ADP121-AUJZ30R7CT-ND ADP122 300mA 3.3V 3.4-5.5V 0.085V @ 300mA -- -- ADP122AUJZ-3.3-R7CT-ND ADP1712 300mA 3.3V 3.5-5.5V 0.17V @ 300mA -- -- ADP1712AUJZ-3.3-R7TR-ND AP7311 (Low Cost) 150mA 3.3V 3.5-6V 0.15V @ 150mA -- -- AP7311-33WG-7DICT-ND LD39015M18R 150mA 1.8V 1.9V-5.5V 0.08V @ 100mA -- -- 497-6977-1-ND LP2985A-33DBVR 150mA 3.3V 3.3-16V 0.28V @ 150mA 206 150 296-18479-1-ND MCP1824T-3302E/OT 300mA 3.3V 3.5V-6V 0.2V @ 300mA -- -- MCP1824T-3302E/OTCT-ND MIC5205-2.5YM5 TR 150mA 2.5V 2.7-16V 0.165V @ 150mA -- -- 576-1257-2-ND MIC5205-3.0YM5 TR 150mA 3.0V 3.2V-16V 0.165V @ 150mA -- -- 576-1258-2-ND MIC5205-3.3YM5 TR 150mA 3.3V 3.5V-16V 0.165V @ 150mA -- -- 576-1259-2-ND TPS780330220 150mA 3.3V+2.2V 3.6-5.5V 250mV Max -- -- 296-23332-1-ND TDA3663/N1,135 100mA 3.3V 3.5-45V 0.18V @ 50mA -- -- 568-5343-1-ND Max operating temp can be calculated using ?JA, TJ (max junction temperature), and power in watts. Set the "Maximum Ambient Temperature" until it reaches TJ ("Max Junction Temperature"), which is the absolute limit for safe use of the regulator: Heat Sink Temperature Calculator <http://www.daycounter.com/Calculators/Heat-Sink-Temperature-Calculator.phtml> For example, With 12V source into a 3.3V LP2985 and a 30mA load, we are dissipating (12V-3.3V) * 0.03A = 0.261W. With a ?JA of 206 °C/W, a TJ of 150°C, and 261mW we can safely use the chip without a heat sink up to 75°C (=147.1°C Junction Temperature).
U4 = SparkFun-IC-Power:PAM2401: PAM2401 - Boost PMIC Specifications: Up to 1A output current 0.9V to 4.75V Input Range 2.5V to 5.0V Adjustable Output Voltage Datasheet <https://www.diodes.com/assets/Datasheets/PAM2401.pdf> (Diodes inc.); PROD_ID: IC-13769
U5 = GPRS+GSM+GPS Shield v1.0:MICROSIM
U6 = Quectel:BC92
U7 = SIM-ST-MFF2:SIM-ST-MFF2: GLOBAL IOT EMBEDDED SIM CHIP Check prices <https://pricing.snapeda.com/parts/SIM-ST-MFF2/Hologram%2C%20Inc./view-part?ref=eda>; AVAILABILITY: Bad; DESCRIPTION: GLOBAL IOT EMBEDDED SIM CHIP; MF: Hologram, Inc.; MP: SIM-ST-MFF2; PACKAGE: None; PRICE: None
U8 = USBLC6:USBLC6-2SC6Y; BUILT_BY: EMA_UL_Team; MANUFACTURER_PART_NUMBER: USBLC6-2SC6Y; SOURCELIBRARY: StMicro_2015-03-30; VENDOR: STMicroelectronics
U$1 = adafruit:2.1MMJACK: 2.1mm x 5.5mm THM DC jack with internal switch. Digikey part #PJ-102A, 4UCON part #05537 2.1mm x 5.5mm SMT DC jack with internal switch. Digikey part #PJ-002A-SMT, 4UCON part #03267 By microbuilder.eu & adafruit.com
X1 = adafruit:XTAL: Low cost SMT crystals, no capacitors included http://www.ladyada.net/library/eagle

## Net classes
0 default: width 0.203 mm, drill 0.356 mm, clearance 0.203 mm
1 power: width 0.305 mm, drill 0.356 mm, clearance 0.203 mm
2 gnd: width 0.203 mm, drill 0.356 mm, clearance 0.203 mm
3 usbvcc: width 0.203 mm, drill 0.356 mm, clearance 0.203 mm
4 aref: width 0.203 mm, drill 0.356 mm, clearance 0.203 mm
5 antenna: width 0.8 mm, drill 0.356 mm, clearance 0.15 mm
6 usb_diff: width 0.261 mm, drill 0.356 mm, clearance 0.203 mm

## Board
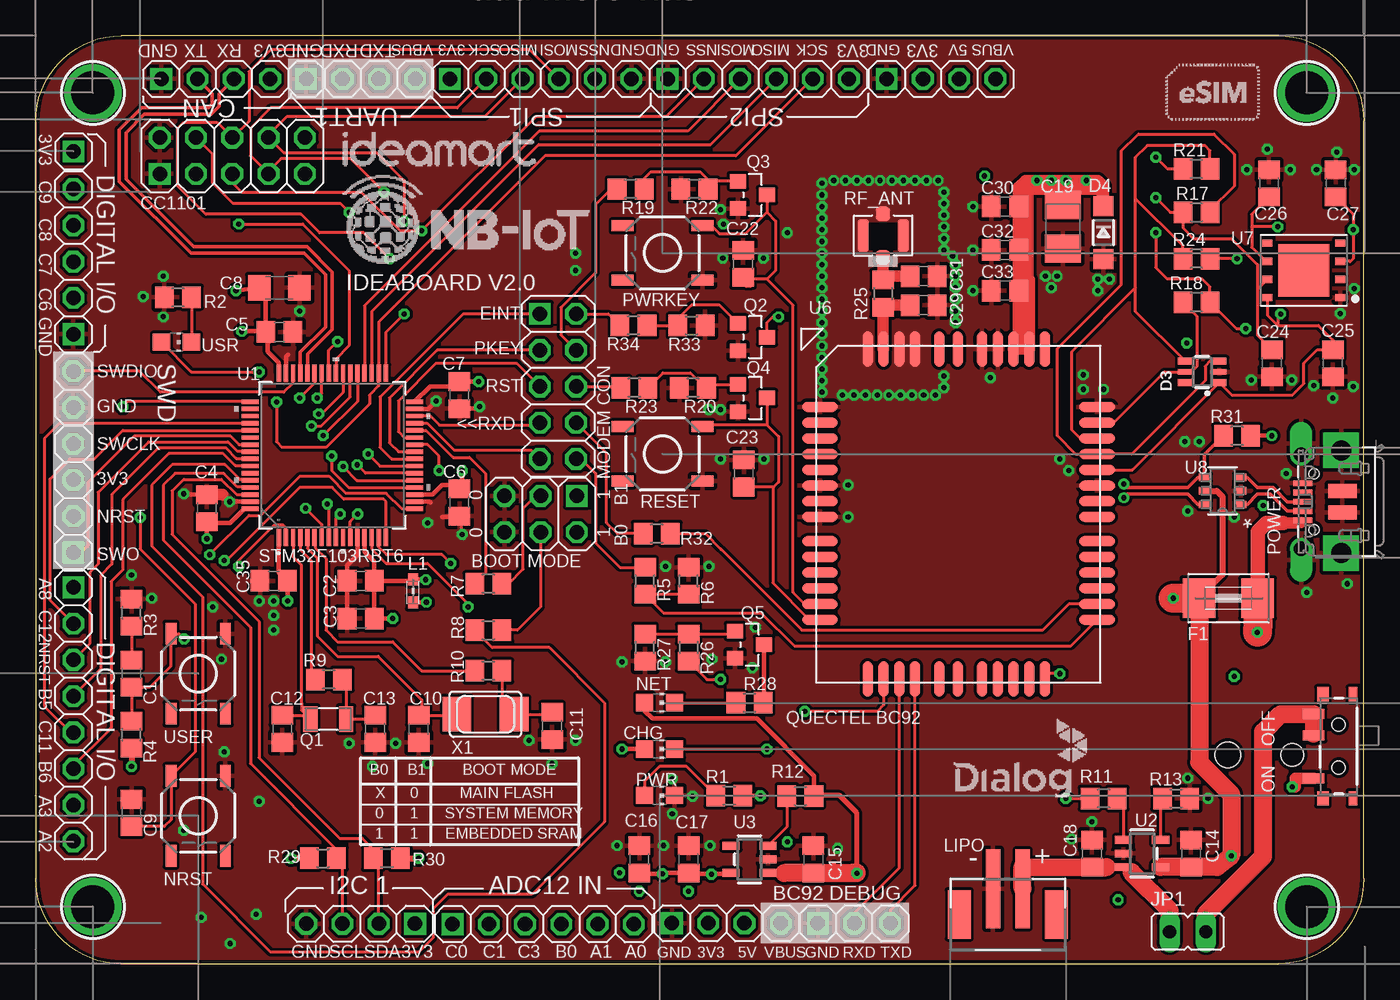
[diagram p4: board, top side]
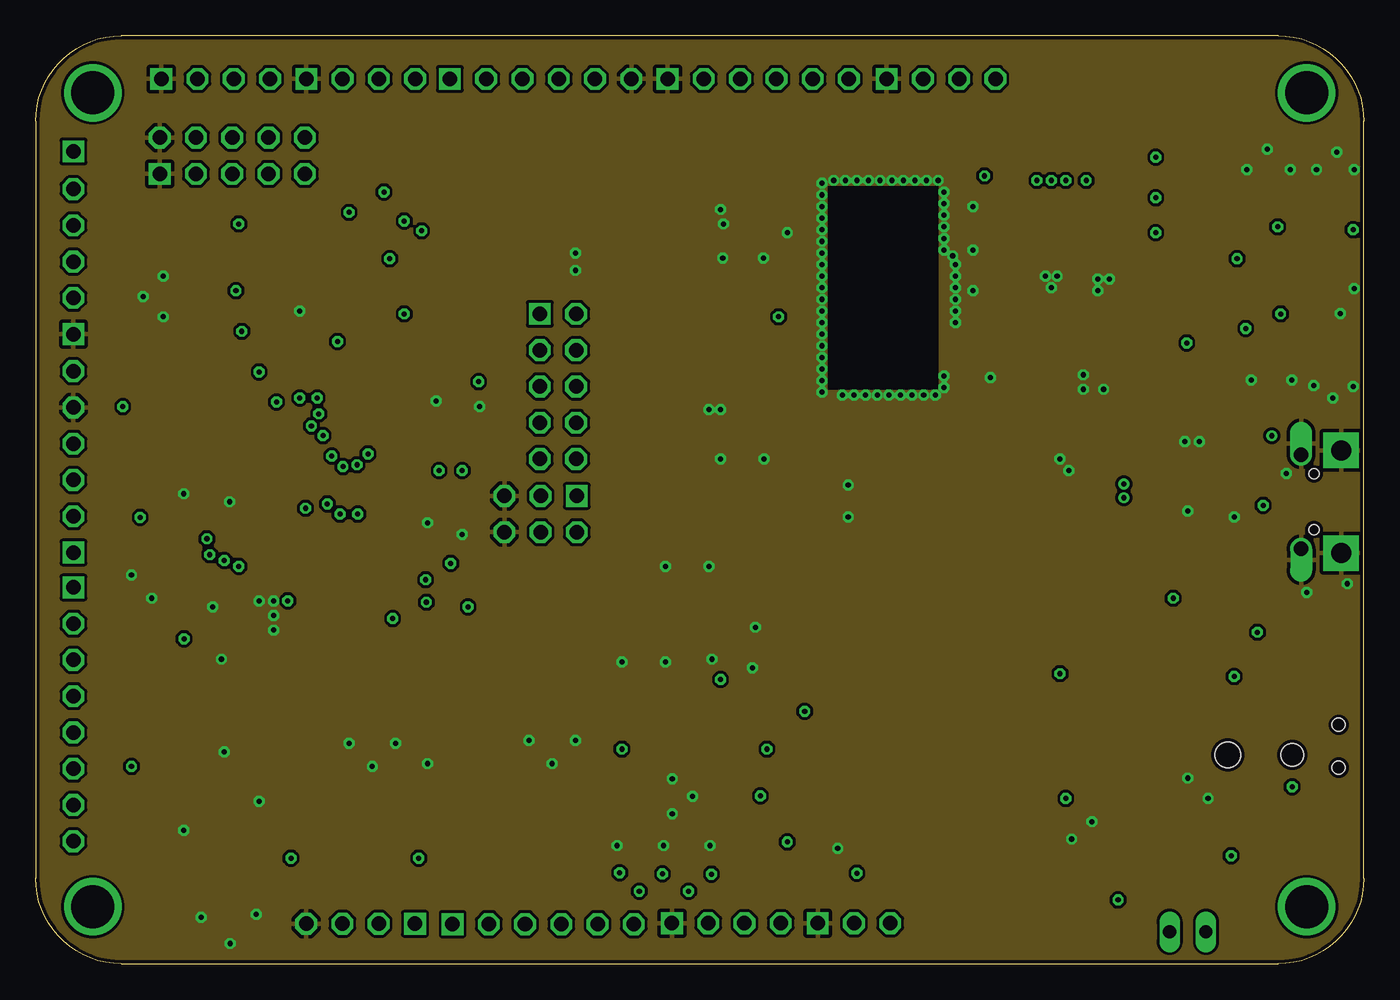
[diagram p5: board, inner layer Ground]
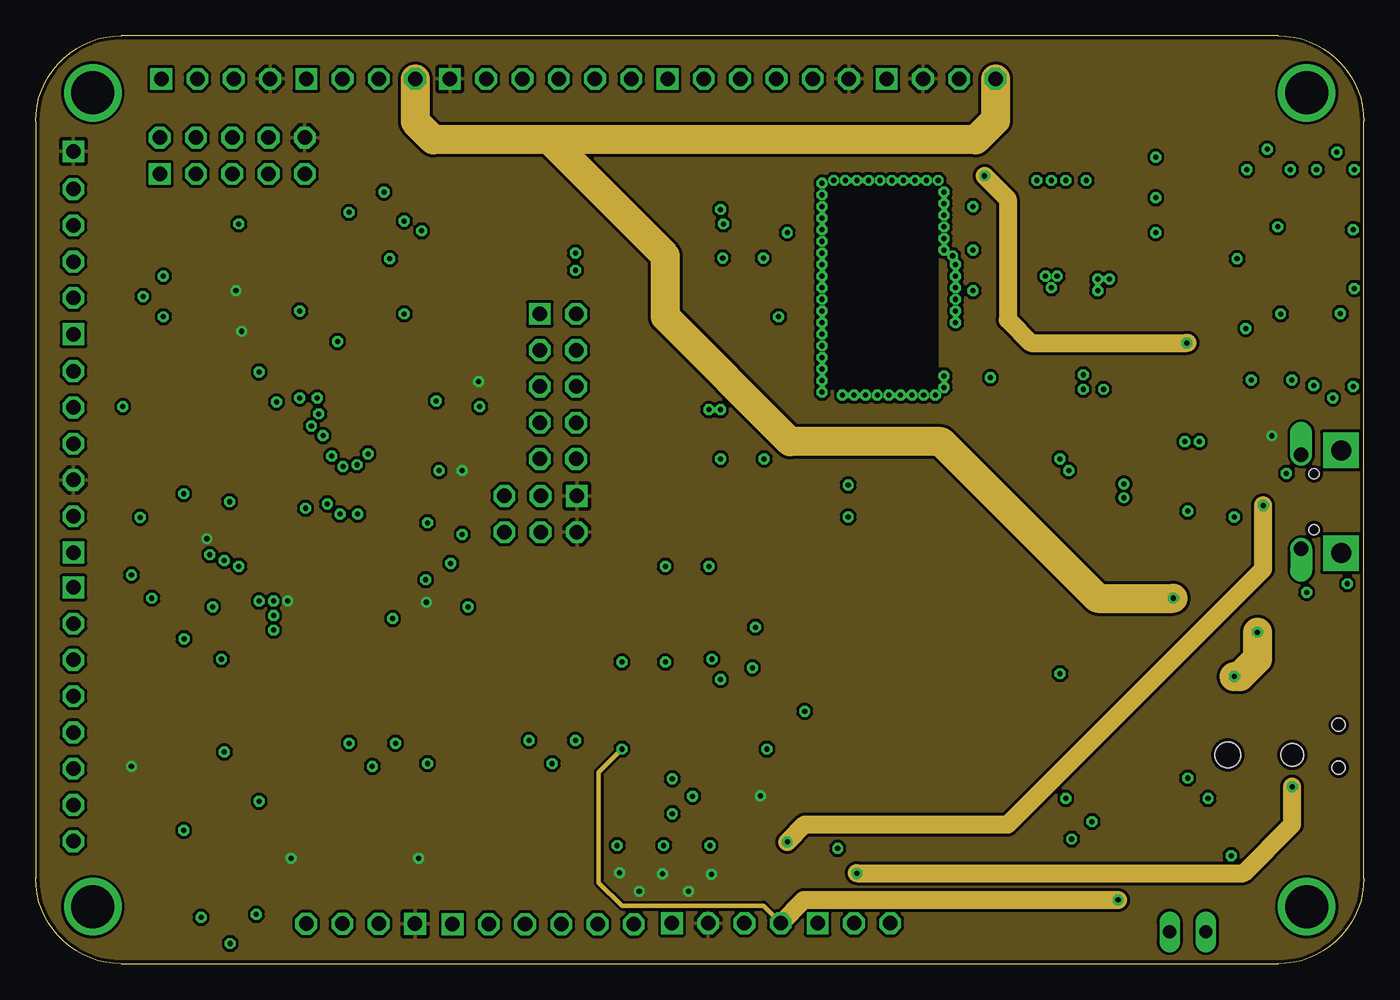
[diagram p6: board, inner layer Power]
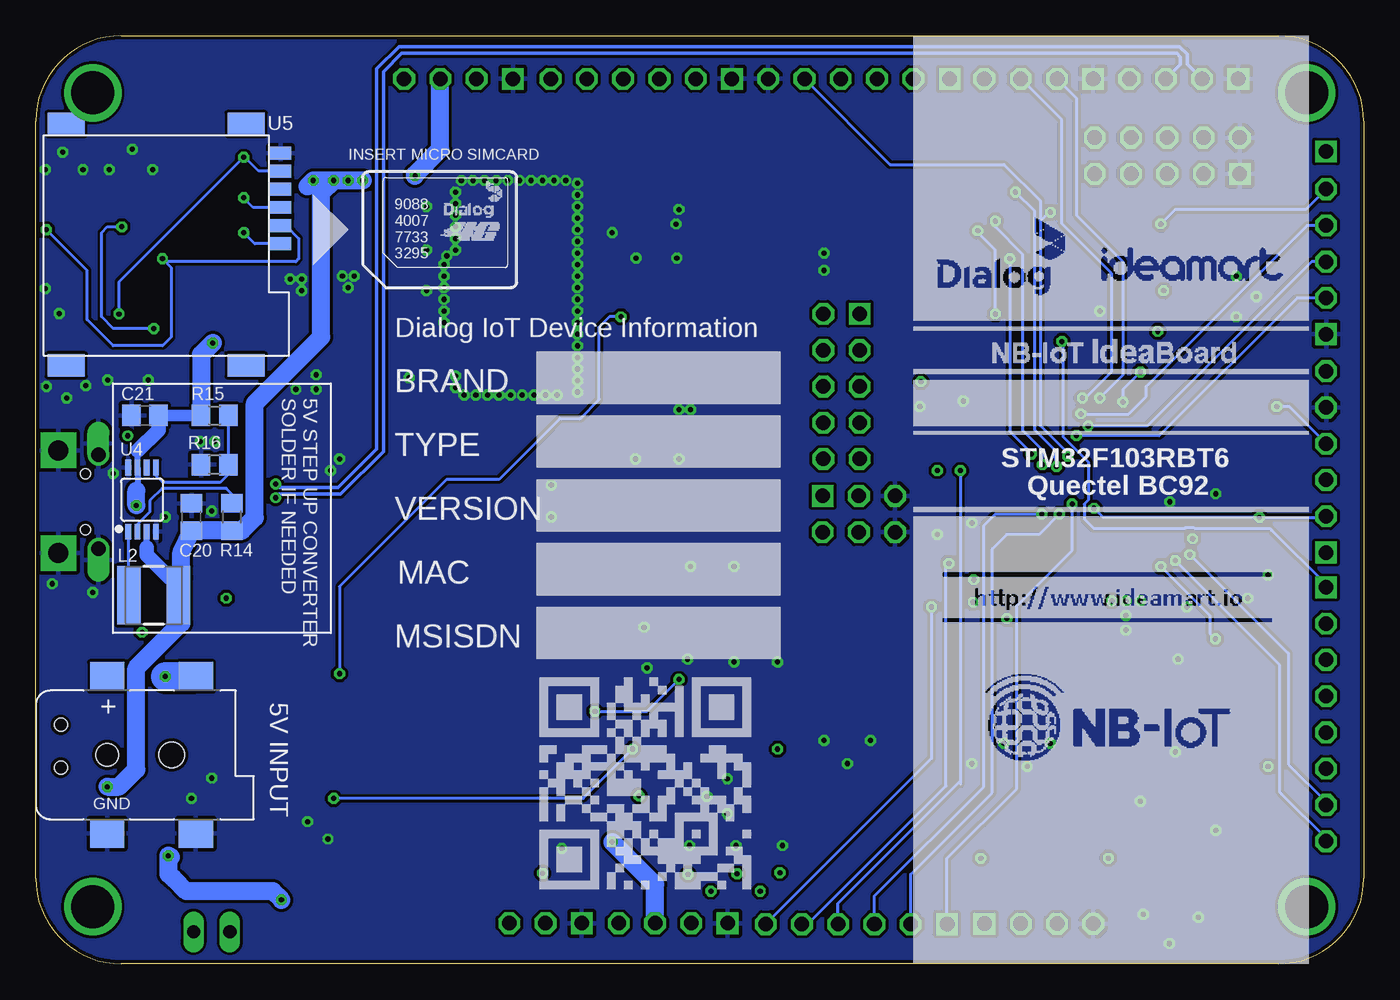
[diagram p7: board, bottom side, seen from below]

Size 93 x 65 mm. Coordinates in mm from the lower left corner, seen from the top.
Outline: 6,0 87,0 arc90 93,6 93,59 arc90 87,65 6,65 arc90 0,59 0,6 arc90 6,0
Copper layers (1*2+15*16): Top 0.035mm / dielectric 0.2mm / Ground 0.0175mm / dielectric 1.065mm / Power 0.0175mm / dielectric 0.2mm / Bottom 0.035mm
Design rules "default *": minimum track width 6mil, minimum drill 0.35mm, track to track 6mil, track to pad 6mil, pad to pad 6mil, via to via 6mil, smd to smd 6mil, copper to edge 10mil, drill to drill 8mil, minimum pad ring 10mil, minimum via ring 8mil, stop-mask expansion 4mil, vias tented up to drill 14mil, thermal gap 10mil

### Footprints (pad centres in the part's own frame; a part is rotated, then mirrored left to right if it is on the bottom)
MOUNTINGHOLE_3.0_PLATEDTHIN = drill 3 pad 3.6: P$1 0,0
1X06-S = drill 1.016 square: 1 -6.35,0 | drill 1.016 octagon: 2 -3.81,0; 3 -1.27,0; 4 1.27,0; 5 3.81,0; 6 6.35,0
2X03 = drill 1.016 square: 1 -2.54,-1.27 | drill 1.016 octagon: 2 -2.54,1.27; 3 0,-1.27; 4 0,1.27; 5 2.54,-1.27; 6 2.54,1.27
C0805 = smd 1.3 x 1.5: 1 -0.95,0; 2 0.95,0
C1206 = smd 1.6 x 1.8: 1 -1.4,0; 2 1.4,0
B/3528-21R = smd 1.95 x 2.5: + 1.525,0; - -1.525,0
1X04-S = drill 1.016 square: 1 -3.81,0 | drill 1.016 octagon: 2 -1.27,0; 3 1.27,0; 4 3.81,0
2X05 = drill 1.016 square: 1 -5.08,-1.27 | drill 1.016 octagon: 2 -5.08,1.27; 3 -2.54,-1.27; 4 -2.54,1.27; 5 0,-1.27; 6 0,1.27; 7 2.54,-1.27; 8 2.54,1.27; 9 5.08,-1.27; 10 5.08,1.27
CHIP-LED0805 = smd 1.2 x 1.2: A 0,-1.05; C 0,1.05
SOT363 = smd 0.5 x 1: 1 -0.75,-1.2; 3 0.75,-1.2; 4 0.75,1.2; 6 -0.75,1.2 | smd 0.4 x 1: 2 0,-1.2; 5 0,1.2
SOD-123 = smd 1.4 x 1.4: A 1.85,0; C -1.85,0
1X08-S = drill 1.016 square: 1 -8.89,0 | drill 1.016 octagon: 2 -6.35,0; 3 -3.81,0; 4 -1.27,0; 5 1.27,0; 6 3.81,0; 7 6.35,0; 8 8.89,0
1812 = smd 2.286 x 2.794: 1 -2.046,0; 2 2.046,0
1X03-S = drill 1.016 square: 1 -2.54,0 | drill 1.016 octagon: 2 0,0; 3 2.54,0
1X05-S = drill 1.016 square: 1 -5.08,0 | drill 1.016 octagon: 2 -2.54,0; 3 0,0; 4 2.54,0; 5 5.08,0
1X01-S = drill 1.016 square: 1 0,0
JP1 = drill 0.914 long: 1 0,-1.27; 2 0,1.27
0603 = smd 0.85 x 0.7: 1 -0.9,0; 2 0.7,0
INDUCTOR_4X4MM = smd 4.089 x 1.651: P$1 0,1.727; P$2 0,-1.727
JST-PH-2-SMT = smd 1 x 5.5: 1 1.032,-1.8; 2 -1.032,-1.8 | smd 1.6 x 3.4: NC1 -3.4,0; NC2 3.4,0
4UCONN_20329_V2 = smd 1 x 2: BASE@1 -0.75,-2; BASE@2 0.75,-2 | smd 0.4 x 1.35: D+ 0,0.775; D- -0.65,0.775; GND 1.3,0.775; ID 0.65,0.775; VBUS -1.3,0.775 | drill 1.016 pad 1.454 offset: SPRT@1 -3.3,0.9; SPRT@2 3.3,0.9 | drill 1.397 pad 2.5 square: SPRT@3 -3.6,-1.9; SPRT@4 3.6,-1.9 | hole 0.7: -1.95,0; 1.95,0
3.2X1.5 = smd 1 x 1.8: 1 -1.25,0; 2 1.25,0
SOT23 = smd 1.016 x 1.143: 1 -0.95,-1.016; 2 0.95,-1.016; 3 0,1.016
R0805 = smd 1.3 x 1.5: 1 -0.95,0; 2 0.95,0
4P-U-FL = smd 1.016 x 1.016: D -1.524,0; GND3 1.524,0 | smd 2.286 x 0.762: GND1 0,1.397; GND2 0,-1.397
SWITCH-SPST-SMD-A = smd 0.7 x 1.5: 1 -2.25,-1.75; 2 -0.75,-1.75; 3 2.25,-1.75 | smd 1 x 0.6: GND1 -3.65,1; GND3 3.65,1 | smd 1 x 0.8: GND2 -3.65,-1.1; GND4 3.65,-1.1 | hole 0.9: -1.5,0; 1.5,0
TACTILE-SWITCH-SMD = smd 1.524 x 0.762: 1 -2.794,1.905; 2 2.794,1.905; 3 -2.794,-1.905; 4 2.794,-1.905
LQFP64-10X10MM = smd 1.194 x 0.305: 1 -5.75,3.75; 2 -5.75,3.25; 3 -5.75,2.75; 4 -5.75,2.25; 5 -5.75,1.75; 6 -5.75,1.25; 7 -5.75,0.75; 8 -5.75,0.25; 9 -5.75,-0.25; 10 -5.75,-0.75; 11 -5.75,-1.25; 12 -5.75,-1.75; 13 -5.75,-2.25; 14 -5.75,-2.75; 15 -5.75,-3.25; 16 -5.75,-3.75; 33 5.75,-3.75; 34 5.75,-3.25; 35 5.75,-2.75; 36 5.75,-2.25; 37 5.75,-1.75; 38 5.75,-1.25; 39 5.75,-0.75; 40 5.75,-0.25; 41 5.75,0.25; 42 5.75,0.75; 43 5.75,1.25; 44 5.75,1.75; 45 5.75,2.25; 46 5.75,2.75; 47 5.75,3.25; 48 5.75,3.75 | smd 0.305 x 1.194: 17 -3.75,-5.75; 18 -3.25,-5.75; 19 -2.75,-5.75; 20 -2.25,-5.75; 21 -1.75,-5.75; 22 -1.25,-5.75; 23 -0.75,-5.75; 24 -0.25,-5.75; 25 0.25,-5.75; 26 0.75,-5.75; 27 1.25,-5.75; 28 1.75,-5.75; 29 2.25,-5.75; 30 2.75,-5.75; 31 3.25,-5.75; 32 3.75,-5.75; 49 3.75,5.75; 50 3.25,5.75; 51 2.75,5.75; 52 2.25,5.75; 53 1.75,5.75; 54 1.25,5.75; 55 0.75,5.75; 56 0.25,5.75; 57 -0.25,5.75; 58 -0.75,5.75; 59 -1.25,5.75; 60 -1.75,5.75; 61 -2.25,5.75; 62 -2.75,5.75; 63 -3.25,5.75; 64 -3.75,5.75
SOT23-5 = smd 0.55 x 1.2: 1 -0.95,-1.3; 2 0,-1.3; 3 0.95,-1.3; 4 0.95,1.3; 5 -0.95,1.3
MSOP8 = smd 0.4 x 1.1: 1 -0.975,-2.25; 2 -0.325,-2.25; 3 0.325,-2.25; 4 0.975,-2.25; 5 0.975,2.25; 6 0.325,2.25; 7 -0.325,2.25; 8 -0.975,2.25
MICROSIM = smd 1.5 x 0.9: 1 -0.8,2.5; 2 -0.8,5.04; 3 -0.8,7.58; 5 -0.8,1.23; 6 -0.8,3.77; 7 -0.8,6.31 | smd 2.61 x 1.56: P$1 1.6,-0.8; P$2 14.2,-0.8; P$3 14.2,16.1; P$4 1.6,16.1
BC92 = smd 2.5 x 0.7: 1 -9.7,7.5; 2 -9.7,6.4; 3 -9.7,5.3; 4 -9.7,4.2; 5 -9.7,3.1; 6 -9.7,-1.9; 7 -9.7,-3; 8 -9.7,-4.1; 9 -9.7,-5.2; 10 -9.7,-6.3; 11 -9.7,-7.4; 21 9.7,-7.4; 22 9.7,-6.3; 23 9.7,-5.2; 24 9.7,-4.1; 25 9.7,-3; 26 9.7,-1.9; 27 9.7,3.1; 28 9.7,4.2; 29 9.7,5.3; 30 9.7,6.4; 31 9.7,7.5; 43 9.7,-0.2; 44 9.7,0.9; 45 9.7,2; 48 -9.7,2; 49 -9.7,0.9; 50 -9.7,-0.2 | smd 0.7 x 2.5: 12 -6.35,-11.55; 13 -5.25,-11.55; 14 -4.15,-11.55; 15 -3.05,-11.55; 16 1.65,-11.55; 17 2.75,-11.55; 18 3.85,-11.55; 19 4.95,-11.55; 20 6.05,-11.55; 32 6.05,11.55; 33 4.95,11.55; 34 3.85,11.55; 35 2.75,11.55; 36 1.65,11.55; 37 -3.05,11.55; 38 -4.15,11.55; 39 -5.25,11.55; 40 -6.35,11.55; 41 -1.35,-11.55; 42 -0.05,-11.55; 46 -0.05,11.55; 47 -1.35,11.55
PSON127P500X600X82-9N = smd 0.71 x 0.51: 1 -2.55,1.905; 2 -2.55,0.635; 3 -2.55,-0.635; 4 -2.55,-1.905; 5 2.55,-1.905; 6 2.55,-0.635; 7 2.55,0.635; 8 2.55,1.905 | smd 3.6 x 3.7: 9 0,0
SOT23-6L_STM-L = smd 0.775 x 0.508: 1 -1.264,0.95; 2 -1.264,0; 3 -1.264,-0.95; 4 1.264,-0.95; 5 1.264,0; 6 1.264,0.95
DCJACK_2MM_SMT = smd 2.4 x 2: GND 0,-5.5; GNDBREAK 6.2,-5.5; PWR1 0,5.5; PWR2 6.2,5.5 | hole 1.6: 0,0 | hole 1.8: 4.5,0
NX5032 = smd 2 x 2.4: P$1 2,0; P$2 -2,0

### Placement (x,y rotation side)
$H1  89,61 0 top
$H2  4,4 0 top
$H3  89,4 0 top
$H4  4,61 0 top
ANALOG  35.54,2.78 0 top
BOOT  35.36,31.5 180 top
C1  6.71,20.32 270 top
C2  22.76,26.82 0 top
C3  22.76,24.18 0 top
C4  11.99,31.9 270 top
C5  17.07,44.25 180 top
C6  29.67,32.31 90 top
C7  29.67,39.83 90 top
C8  17.07,47.35 180 top
C9  6.71,10.57 90 top
C10  26.82,16.46 270 top
C11  36.17,16.66 270 top
C12  17.27,16.46 270 top
C13  23.77,16.46 270 top
C14  80.9,7.73 270 top
C15  54.46,7.32 270 top
C16  42.27,7.32 270 top
C17  45.72,7.32 270 top
C18  73.96,7.72 90 top
C19  71.93,51.61 90 top
C20  82.09,31.29 270 bottom
C21  85.34,38.4 0 bottom
C22  49.53,49.02 270 top
C23  49.58,34.34 270 top
C24  86.56,42.06 90 top
C25  90.83,42.06 270 top
C26  86.36,54.66 90 top
C27  91.03,54.66 270 top
C29  62.18,46.13 180 top
C30  67.87,53.04 0 top
C31  62.18,48.16 180 top
C32  67.87,49.99 0 top
C33  67.87,47.14 0 top
C35  16.66,26.82 0 top
CAN  12.6,61.98 0 top
CC1101  13.77,56.59 0 top
CHG  43.69,15.04 270 top
D3  81.69,41.45 90 top
D4  74.78,51.21 270 top
DIGITAL  2.64,17.48 270 top
F1  83.52,25.6 0 top
I2C1  22.75,2.81 180 top
JP1  57.3,2.84 0 top
JP2  2.64,49.17 90 top
JP3  2.64,56.9 0 top
JP4  80.67,2.24 270 top
L1  26.42,26.01 270 top
L2  84.73,25.81 270 bottom
LED  9.86,43.54 270 top
LIPO  68.07,3.45 180 top
MODEMCTL  36.58,40.44 270 top
NET  43.69,18.29 270 top
POWER  89.51,32.36 90 top
POWER-PINS  48.36,2.84 0 top
POWER-PINS1  63.4,61.98 0 top
PWR  43.69,11.79 270 top
Q1  20.49,17.14 180 top
Q2  50.19,43.89 270 top
Q3  50.19,53.85 270 top
Q4  50.19,39.62 270 top
Q5  49.99,22.35 270 top
R1  48.56,11.79 0 top
R2  9.96,46.69 0 top
R3  6.71,24.59 90 top
R4  6.71,16.05 90 top
R5  42.67,26.82 90 top
R6  45.72,26.82 90 top
R7  31.7,26.62 180 top
R8  31.7,23.37 0 top
R9  20.52,19.91 180 top
R10  31.7,20.52 180 top
R11  74.78,11.58 180 top
R12  53.55,11.75 0 top
R13  79.86,11.58 0 top
R14  79.25,31.29 90 bottom
R15  80.47,38.4 0 bottom
R16  80.47,34.95 180 bottom
R17  81.28,52.63 0 top
R18  81.28,46.33 180 top
R19  41.66,54.25 180 top
R20  46.02,40.34 180 top
R21  81.28,55.68 0 top
R22  46.13,54.25 180 top
R23  41.91,40.34 180 top
R24  81.28,49.38 180 top
R25  59.33,46.94 270 top
R26  45.72,22.15 270 top
R27  42.67,22.15 90 top
R28  49.99,18.29 0 top
R29  20.12,7.4 0 top
R30  24.59,7.4 180 top
R31  84.12,36.98 180 top
R32  43.48,30.12 180 top
R33  45.92,44.7 0 top
R34  41.86,44.7 180 top
RF_ANT  59.33,51 90 top
S1  91.24,15.24 270 top
S2  11.38,10.36 270 top
S3  43.89,49.78 180 top
S4  11.38,20.32 270 top
S6  43.89,35.71 180 top
SPI1  35.36,61.98 0 top
SPI2  50.6,61.98 0 top
SWD  2.64,35.15 90 top
U1  20.78,35.61 90 top
U2  77.47,7.72 270 top
U3  49.99,7.32 90 top
U4  85.55,32.51 0 bottom
U5  76.66,58.01 180 bottom
U6  64.62,31.5 0 top
U7  88.8,48.56 180 top
U8  83.11,33.12 180 top
U$1  87.99,14.63 0 bottom
USART1  22.76,61.98 0 top
X1  31.5,17.48 0 top

### Tracks (layer width: path | path; a pad name or v marks a point on that pad's centre or on a via)
+3V3  (via drill 0.36)
  Top 0.305: C5.2 16.47,43.7 16.26,43.48 16.26,42.88 17.03,42.1 U1.48 | C5.2 16.12,46.69 C8.2 v14.02,47.14 | C5.2 16.27,44.3 v14.43,44.3 | v11.99,29.77 C4.2 12.26,30.89 13.61,30.89 14.59,31.86 U1.64 | U1.1 17.03,27.41 C35.2 v17.65,25.43 | 27.23,32.86 U1.19 27.78,32.86 28.45,33.53 29.87,33.53 | 29.47,32.86 C6.2 29.87,33.53 | 29.87,33.53 v29.87,34.54 | v31.01,40.77 C7.2 29.33,40.44 27.6,40.44 U1.32 | C16.2 42.33,6.3 v43.89,6.3 43.96,6.37 C17.2 45.79,6.3 48.62,6.3 U3.5 | L1.2 27.19,25.31 27.2,25.3 27.33,25.3 v27.36,25.32 | R1.2 v50.75,11.76 | R31.1 v86.56,36.98
  Top 0.406: R29.1 18.83,7.33 18.69,7.4 v17.88,7.4 | R30.1 v26.82,7.4 | R4.1 v6.71,13.82
  other vias: 40.89,6.38 47.32,6.27 42.27,5.08 45.72,5.08
  pour Power: -4.47,70.71 96.52,70.71 96.52,-2.24 -4.47,-2.24
+4.1V
  Top 0.406: 74.98,6.77 U2.3 76.73,6.42
  Top 1.27: LIPO.2 69.1,6.8 C18.1 74.98,6.77 | JP4.1 79.4,3.74 76.73,6.42
+5V  (via drill 0.36)
  Power 1.27: v52.63,8.53 53.85,9.75 68.07,9.75 85.95,27.64 v85.95,32.11 | 80.67,43.48 v80.61,43.48 69.7,43.48 68.07,45.11 68.07,53.56 v66.45,55.18
  Bottom 0.203: 85.95,33.12 85.95,33.51 85.87,33.63
  Bottom 0.406: 85.87,35.95 U4.7 85.87,33.63 86.08,33.22
  Bottom 0.813: C21.2 R15.1
  Bottom 1.016: 85.87,35.95 84.39,37.37 C21.2
  Bottom 1.27: POWER-PINS.3 49.63,5.54 v52.63,8.53 | v85.95,32.11 85.95,33.12 | POWER-PINS1.3 64.67,57.05 66.45,55.27 v66.45,55.18 | v80.61,43.48 81.42,42.67 R15.1
BC92_PSM_EINT  (via drill 0.36)
  Top 0.203: v71.73,20.32 71.04,20.32 U6.20 | Q2.3 51.21,44.91 51.61,45.31 v52.02,45.31
  Bottom 0.203: v71.73,20.32 71.73,26.42 64.21,33.93 60.55,33.93 56.29,38.2 54.86,38.2 53.54,39.52 53.54,44.6 52.83,45.31 v52.02,45.31
BC92_PWRKEY
  Top 0.203: Q3.3 51.21,52.63 | 49.73,47.46 C22.2 49.65,47.96 51.21,47.96 | 49.73,47.46 50.07,47.46 | 50.17,47.9 49.73,47.46 | U6.10 53.85,25.2 53.03,26.01 53.03,46.13 51.21,47.96 | 51.21,52.63 51.82,52.02 51.82,48.56 51.21,47.96 | S3.3 47.32,51.69 47.87,51.13 49.71,51.13 51.21,52.63
BC92_PWRKEY_MCU
  Top 0.203: MODEMCTL.4 36.78,44.04 36.78,45.96 39.22,48.4 39.22,53.17 40.3,54.25 R19.2
BC92_RESET
  Top 0.203: 51.21,39.22 Q4.3 51.21,37.74 | 49.51,33.46 C23.2 51.61,33.39 | 51.61,33.39 51.68,33.39 52.02,33.73 52.02,36.78 52.02,36.93 51.21,37.74 | 51.61,33.39 51.61,26.67 54.19,24.1 U6.11 | 51.21,37.74 46.81,37.74 S6.3
BC92_RESET_MCU
  Top 0.203: MODEMCTL.6 40.86,40.44 R23.2
BC92_RX
  Top 0.203: R5.1 42.81,25.74 | 42.81,25.74 43.96,24.59 50.8,24.59 53.14,22.25 72.47,22.25 U6.21 | R6.1 42.94,25.87 42.81,25.74
BC92_TX
  Top 0.203: U6.22 72.34,25.2 70.51,23.37 53.64,23.37 48.01,29.01 47.95,29.06 46.89,30.12 R32.1
BOOT0
  Top 0.203: U1.60 14.98,33.9 14.3,33.9 13.26,34.95 9.55,34.95 8.13,33.53 8.13,29.26 11.68,25.7 11.68,5.59 16.46,0.81 26.82,0.81 27.84,1.83 27.84,3.86 28.85,4.88 34.75,4.88 39.83,9.96 39.83,18.29 35.97,22.15 31.97,22.15 R8.1
BOOT1
  Top 0.203: U1.28 27.33,37.36 29.23,35.46 30.38,35.46 31.5,34.34 31.5,27.37 R7.2
DBG_RXD
  Top 0.203: U6.14 60.47,6.71 57.3,3.54 JP1.2
DBG_TXD
  Top 0.203: U6.15 61.57,5.49 59.84,3.76 JP1.3
EN
  Bottom 0.203: U4.2 85.87,30.79 85.01,31.65 85.01,32.44 84.16,33.29 79.65,33.29 78.84,32.48 R14.2
GND  (via drill 0.36)
  Top 0.203: C6.1 v29.87,30.07
  Top 0.305: 7.86,25.54 7.93,25.6 v8.13,25.6 | C4.1 10.43,32.85 v10.36,32.92 | U1.63 v13.57,32.36 13.08,32.85 | C6.1 29.8,31.29 28.45,31.29 | U1.18 27.58,32.36 27.64,32.31 | C7.1 30.95,38.88 v31.09,39.01 | U1.31 27.48,38.86 v28.04,39.42 | U1.47 17.53,42.52 17.68,42.67 | C2.1 C3.1 | 21.95,26.96 C2.1 | U1.12 22.53,28.62 21.81,27.9 C2.1
  Top 0.813: C4.1 13.08,32.85 13.09,32.85
  other vias: 15.65,25.4 12.4,24.99 27.43,30.89 16.66,25.4 16.66,24.38 16.66,23.37 37.8,15.65 36.17,14.02 34.54,15.65 21.95,15.44 23.57,13.82 27.43,14.02 25.2,15.44 13.21,14.83 10.36,9.35 15.65,11.38 11.58,3.25 15.44,3.45 13.61,1.42 13,21.34 6.71,27.23 18.49,45.72 37.8,49.78 37.8,48.56 7.52,46.74 8.94,48.16 8.94,45.31 48.16,51.82 47.96,52.83 52.63,51.21 48.11,49.43 50.95,49.43 64.41,48.97 64.41,46.53 64.41,45.72 66.85,41.05 56.49,39.83 56.9,33.53 56.9,31.29 72.34,34.54 73.36,40.23 73.36,41.25 74.78,40.23 82.09,11.58 80.67,13 73.96,9.96 72.54,8.74 92.25,40.44 90.83,39.62 89.48,40.49 87.96,40.89 85.12,40.89 91.36,45.54 92.33,47.29 92.33,55.63 89.69,55.63 87.86,55.63 84.81,55.63 86.23,57.05 91.11,56.85 44.58,10.52 44.58,12.95 46,11.73 40.72,8.28 43.97,8.28 47.22,8.28 47.35,21.34 50.19,20.73 50.39,23.57 44.09,21.13 41.05,21.13 47.14,27.84 44.09,27.84 91.85,26.62 89,26.01 87.58,34.34 81.48,36.58 80.47,36.58 80.67,31.7 47.96,35.36 51,35.36 74.37,47.96 75.18,47.96 74.37,47.14 47.96,38.81 47.14,38.81 56.16,8.08 57.3,39.83 58.12,39.83 58.93,39.83 59.74,39.83 60.55,39.83 61.37,39.83 62.18,39.83 63.6,40.36 55.07,40.03 55.07,40.84 55.07,41.66 55.07,42.47 55.07,43.28 55.07,44.09 55.07,44.91 55.07,45.72 55.07,46.53 55.07,47.35 55.07,48.16 55.07,48.97 55.07,49.78 55.07,50.6 55.07,51.41 55.07,52.22 55.07,53.04 55.07,53.85 55.07,54.66 55.88,54.86 56.69,54.86 57.51,54.86 58.32,54.86 59.13,54.86 59.94,54.86 60.76,54.86 61.57,54.86 62.38,54.86 63.2,54.86 63.6,54.05 63.6,53.24 63.6,52.43 63.6,51.61 63.6,50.8 63.6,49.99 64.21,49.58 64.41,48.16 64.41,47.35 64.41,44.91 62.99,39.83 63.6,41.17 83.92,31.29 71.53,48.16 70.71,48.16 71.12,47.35 65.63,53.04 65.63,49.99 65.63,47.14 71.73,35.36
  pour Top (rank 6): -1.63,69.09 95.5,69.09 95.5,-1.63 -1.63,-1.63
  pour Ground: -3.25,69.9 -3.25,-3.25 95.5,-3.25 95.5,69.9
  pour Bottom: 95.5,68.88 -1.22,68.88 -1.22,-1.22 95.5,-1.22
  pour Top (no thermals): 57.51,44.7 62.38,44.7 62.38,40.84 57.51,40.84
  pour Top (no thermals): 57.2,53.39 61.67,53.39 61.67,49.28 57.2,49.28
I2C1_SCL
  Top 0.203: R29.2 | U1.61 14.98,33.4 14.11,33.4 13.17,34.34 9.75,34.34 8.94,33.53 8.94,29.67 15.04,23.57 15.04,14.02 21.07,7.99 R29.2 | R29.2 21.07,7.32 21.48,6.9 I2C1.3
I2C1_SDA
  Top 0.203: U1.62 14.08,32.86 13,33.93 10.36,33.93 9.55,33.12 9.55,30.07 15.65,23.98 15.65,14.43 21.27,8.8 22.86,8.8 23.64,8.03 R30.2 | R30.2 23.64,7.6 23.57,7.6 | R30.2 23.64,7.11 24.02,6.73 I2C1.2
JNTRST
  Top 0.203: U1.56 14.98,35.9 14.12,35.9 13.47,36.55 7.9,36.55 4.37,33.02 4.37,27.99 3.81,27.43 3.81,22.45 DIGITAL.3
JTCK/SWCLK  (via drill 0.36)
  Top 0.203: U1.49 6.44,39.36 v6.1,39.01
  Bottom 0.203: SWD.4 5.23,39.01 v6.1,39.01
JTDO/SWO
  Top 0.203: U1.55 14.24,36.36 13.64,36.95 6.89,36.95 3.66,33.72 3.66,29.26 3.2,28.8 SWD.1
JTMS/SWDIO
  Top 0.203: U1.46 17.98,41.32 17.98,40.64 17.38,40.03 8.74,40.03 7.26,41.5 SWD.6
N$1
  Top 0.203: R7.1 33.12,26.62 34.14,27.64 34.14,31.9 35,32.77 BOOT.3
N$2
  Top 0.203: Q3.1 47.42,54.8 R22.1 47.08,54.93 46.53,55.47 43.08,55.47 42.61,55 R19.1
N$3
  Top 0.203: R1.1 45.58,13.82 43.69,13.82 42.64,12.77 PWR.A
N$4
  Top 0.203: R23.1 43.92,41.39 45.85,41.39 46.39,40.85 46.75,40.85 R20.1 47.21,40.57 Q4.1
N$5
  Top 0.203: R12.1 52.6,9.58 U3.3
N$6
  Top 0.8: RF_ANT.D R25.1 59.6,48.16 C31.2
N$7
  Top 0.203: C11.1 36.03,17.48 X1.P$1 32.65,18.32 R10.1
N$8
  Top 0.203: Q1.1 | Q1.1 23.51,17.14 C13.1 | R9.1 21.74,19.64 Q1.1
N$9  (via drill 0.36)
  Top 0.203: CHG.C v51.21,15.04 | v72.14,11.58 R11.2
  Bottom 0.203: v51.21,15.04 54.66,11.58 v72.14,11.58
N$10
  Top 0.203: NET.C R28.1
N$11
  Top 0.203: R11.1 76.17,11.14 U2.1
N$12
  Top 0.203: MODEMCTL.10 38.2,35.36 39.22,34.34 39.22,29.46 40.91,27.77 R5.2
N$13
  cutout Ground (no thermals): 55.47,40.23 63.2,40.23 63.2,54.46 55.47,54.46
N$14
  cutout Power: 55.47,40.23 63.2,40.23 63.2,54.46 55.47,54.46
N$15
  cutout Top: 58.12,51.92 60.55,51.92 60.55,49.99 58.12,49.99
N$16
  Top 0.305: Q5.3 51,18.35 R28.2
N$17
  Top 0.203: MODEMCTL.8 39.98,35.76 39.98,30.89 40.74,30.12 R32.2
N$18
  Top 0.203: R27.2 R26.1 48.77,23.1 48.9,23.23
  Top 0.305: 48.9,23.23 Q5.1
N$19
  Top 0.203: R3.1 C1.1
N$20
  Top 0.203: U2.5 78.77,11.44 R13.1
N$21
  Bottom 0.203: R15.2 R16.1 79.52,34.27 80.06,33.73 84.12,33.73 84.57,34.18 U4.5
N$22
  Bottom 0.203: L2.P$2 86.72,25.87 86.69,26.64 86.52,26.81 U4.1
N$23
  Top 0.203: R34.1 44.91,44.7 | 44.91,44.7 R33.1 | Q2.1 47.89,46.13 45.92,46.13 44.91,45.11 44.91,44.7
N$24
  Top 0.406: 89.49,16.1 S1.2
  Top 1.27: 89.49,16.1 S1.1 87.19,17.49 85.95,16.26 85.95,7.52 81.94,3.51 JP4.2
N$25
  Top 0.203: BOOT.4 35.36,24.99 33.73,23.37 R8.2
N$26
  Top 0.203: R2.2 LED.C
NETLIGHT  (via drill 0.36)
  Top 0.203: 59.37,19.1 U6.13 59.37,18.12 58.93,17.68 v53.85,17.68 | R26.2 47,19.91 v47.95,19.91
  Bottom 0.203: v53.85,17.68 50.19,17.68 v47.95,19.91
NRST  (via drill 0.36)
  Top 0.203: v18.9,31.9 20.03,30.77 U1.7 | v7.32,31.27 7.32,29.06 11.18,25.2 11.18,14.86 S2.3 9.47,10.08 9.01,9.62 C9.1
  Bottom 0.203: v18.9,31.9 18.29,31.29 7.34,31.29 v7.32,31.27 2.72,31.27 SWD.2
OSC32_IN
  Top 0.203: C12.1 18.97,17.41 Q1.2 18.62,17.76 18.62,18.29 18.59,18.31 18.59,27.94 18.03,28.51 U1.3
OSC32_OUT
  Top 0.203: U1.4 18.53,29.02 19.3,28.24 19.3,20.18 R9.2
OSC_IN
  Top 0.203: C10.1 27.03,17.41 | 27.03,17.41 29.43,17.41 X1.P$2 | U1.5 19.03,29.1 19.71,28.41 19.71,22.96 21.13,21.54 23.98,21.54 27.03,18.49 27.03,17.41
OSC_OUT
  Top 0.203: U1.6 19.57,29.82 19.57,29.14 20.32,28.39 20.32,23.37 21.13,22.56 24.99,22.56 27.03,20.52 R10.2
PA0  (via drill 0.36)
  Top 0.203: U1.14 23.53,29.06 24.54,28.04 27.43,28.04 30.28,25.2 v30.28,24.99
  Bottom 0.203: v30.28,24.99 30.28,14.39 ANALOG.6
PA1  (via drill 0.36)
  Top 0.203: v29.06,28.04 28.45,28.65 24.56,28.65 24.03,29.18 U1.15
  Bottom 0.203: v29.06,28.04 29.26,27.84 29.26,12.46 29.5,12.22 38.95,2.78 ANALOG.5
PA2  (via drill 0.36)
  Top 0.203: U1.16 24.53,32.37 24.35,32.55 21.57,32.55 20.76,33.36 18.49,33.36 13.38,28.24 v13.21,28.24
  Bottom 0.203: v13.21,28.24 5.89,20.93 5.89,12.04 5.77,11.91 2.64,8.78 DIGITAL.8
PA3  (via drill 0.36)
  Top 0.203: U1.17 25.64,31.86 24.55,32.95 21.74,32.95 20.54,34.16 18.51,34.16 15.76,31.4 14.94,31.4 v12.19,28.65
  Bottom 0.203: v12.19,28.65 5.28,21.74 5.28,13.97 2.64,11.33 DIGITAL.7
PA4  (via drill 0.36)
  Top 0.203: v20.73,35.56 20.73,34.54 21.91,33.36 U1.20 | v21.95,52.63 21.34,53.24 13.82,53.24 12.4,54.66 12.4,56.69 CC1101.4
  Bottom 0.203: 22.66,52.02 22.66,53.44 25.2,55.98 33.17,55.98 SPI1.5 | 22.66,52.02 22.66,37.69 20.73,35.76 v20.73,35.56 | 22.66,52.02 22.05,52.63 v21.95,52.63
PA5  (via drill 0.36)
  Top 0.203: v21.51,34.82 22.48,33.86 U1.21 | v24.38,54.05 22.05,56.39 17.17,56.39 16.31,55.52 CC1101.7 15.04,56.59 15.04,58.52 16.46,59.94 29.52,59.94 SPI1.2
  Bottom 0.203: v21.51,34.82 21.61,35.97 23.06,37.41 23.06,52.73 v24.38,54.05
PA6  (via drill 0.36)
  Top 0.203: v22.5,34.95 23.09,34.36 U1.22 | v25.81,52.02 25.81,54.86 23.88,56.79 17.37,56.79 CC1101.8 16.31,58.06 17.58,59.33 31.45,59.33 SPI1.3
  Bottom 0.203: v25.81,52.02 25.81,51.61 23.88,49.68 23.88,37.34 22.5,35.97 v22.5,34.95
PA7  (via drill 0.36)
  Top 0.203: v23.27,35.71 24.11,34.86 U1.23 | v24.79,49.38 22.96,51.21 19.88,51.21 18.58,52.5 11.91,52.5 9.96,54.46 9.96,58.52 10.36,58.93 12.7,58.93 CC1101.6 14.93,59.03 14.93,62.48 16.46,64.01 34.59,64.01 SPI1.4
  Bottom 0.203: v23.27,35.71 23.27,35.76 24.79,37.29 v24.79,49.38
PA8  (via drill 0.36)
  Top 0.203: U1.41 20.53,42.98 v21.13,43.59
  Bottom 0.203: v21.13,43.59 21.03,43.48 21.03,36.88 19.3,35.15 19.3,32.47 19.58,32.19 19.58,31.17 18.9,30.48 16.66,30.48 12.55,30.48 12.48,30.56 11.91,30.56 11.83,30.48 6.55,30.48 6.43,30.35 2.64,26.56 DIGITAL.1
PB0  (via drill 0.36)
  Top 0.203: v28.25,34.54 28.25,35.56 27.43,36.37 27.42,36.36 U1.26
  Bottom 0.203: v28.25,34.54 28.25,12.8 | 28.25,12.8 28.25,12.6 | ANALOG.4 36.81,4.24 28.25,12.8
PB5
  Top 0.203: U1.57 14.98,35.4 14.04,35.4 13.31,36.14 8.61,36.14 5.33,32.87 5.33,27.99 4.57,27.23 4.57,20.68 DIGITAL.4
PB6
  Top 0.203: U1.58 14.98,34.9 13.97,34.9 13.14,35.74 9.32,35.74 6.1,32.51 6.1,27.59 5.28,26.78 5.28,16.51 5.06,16.27 2.64,13.85 DIGITAL.6
PB12  (via drill 0.36)
  Top 0.203: U1.33 24.53,44.24 v25.81,45.52 | CC1101.5 13.77,54.71 14.43,54.05 22.81,54.05 25.52,51.33 v27.03,51.33 35.03,59.33 44.14,59.33 SPI2.2
  Bottom 0.203: v25.81,45.52 25.81,49.99 27.03,51.21 v27.03,51.33
PB13  (via drill 0.36)
  Top 0.203: SPI2.5 49.02,56.59 35.66,56.59 24.03,44.96 U1.34 24.03,40.49 23.37,39.83 23.37,39.22 20.32,36.17 17.27,36.17 16.87,36.58 v16.87,39.34 | LED.A 10.89,41.45 v15.65,41.45
  Bottom 0.203: v15.65,41.45 16.87,40.23 v16.87,39.34
PB14
  Top 0.203: U1.35 23.57,41.4 23.57,42.08 23.57,42.09 23.57,45.72 35.22,57.37 47.26,57.37 SPI2.4
PB15
  Top 0.203: SPI2.3 45.67,58.32 35.26,58.32 23.03,46.09 U1.36
PC0  (via drill 0.36)
  Top 0.203: v20.42,32.21 20.53,32.1 U1.8
  Bottom 0.203: v20.42,32.21 20.42,28.96 24.31,25.07 24.31,12.27 29.19,7.39 ANALOG.1
PC1  (via drill 0.36)
  Top 0.203: U1.9 21.03,31.21 v21.31,31.5
  Bottom 0.203: v21.31,31.5 22.73,30.07 24.99,30.07 26.01,29.06 26.01,11.99 31.73,6.27 ANALOG.2
PC3  (via drill 0.36)
  Top 0.203: U1.11 22.03,30.97 v22.56,31.5
  Bottom 0.203: v22.56,31.5 25.81,31.5 26.62,30.68 26.62,12.4 34.27,4.75 ANALOG.3
PC6  (via drill 0.36)
  Top 0.203: U1.37 22.53,39.39 v20.12,36.98 v20.11,36.98
  Bottom 0.203: 3.35,46.63 JP2.2 4.67,46.63 14.33,36.98 v20.11,36.98
PC7  (via drill 0.36)
  Top 0.203: v19.3,37.67 19.99,37.67 22.03,39.71 U1.38
  Bottom 0.203: 19.3,37.59 v19.3,37.67 15.16,37.67 3.66,49.17 JP2.3 2.64,48.56
PC8  (via drill 0.36)
  Top 0.203: U1.39 21.53,40.02 19.91,38.4 19.82,38.5 v19.82,38.52
  Bottom 0.203: 2.44,51.61 JP2.4 3.96,51.71 15.24,40.44 15.24,39.74 16.46,38.52 v19.82,38.52
PC9  (via drill 0.36)
  Top 0.203: U1.40 21.03,42.36 21.95,43.28 21.95,48.56 18.69,51.82 v14.22,51.82
  Bottom 0.203: JP2.5 4.06,52.83 13.21,52.83 v14.22,51.82
PC11
  Top 0.203: U1.52 1.69,37.86 0.61,36.78 0.61,18.03 2.44,16.21 DIGITAL.5
PC12
  Top 0.203: U1.53 6.1,37.36 4.09,35.36 2.4,35.36 1.02,33.97 1.02,25.45 DIGITAL.2
PC13  (via drill 0.36)
  Top 0.203: R4.2 C1.2 7.99,19.37 9.47,20.85 S4.3 10.03,23.11 v10.39,22.76 | U1.2 17.48,29.9 17.48,30.58 17.31,30.76 16.75,30.76 14.22,28.24 v14.22,27.84
  Bottom 0.203: v14.22,27.84 10.77,24.38 10.77,23.14 v10.39,22.76
PSM_EINT
  Top 0.203: MODEMCTL.2 40.1,45.52 R34.2
RF_ANT
  Top 0.8: U6.39 59.33,43.08 R25.2 59.47,46.13 C29.2
SIM1_CLK
  Top 0.203: R18.2 81.29,45.37 81.29,41.83 80.92,41.45 D3.5 79.05,41.45 75.49,37.9 U6.30
SIM1_CLK_CONN  (via drill 0.36)
  Top 0.203: C26.1 85.14,52.49 85.14,51.61 | 85.14,51.61 85.14,50.19 86.13,49.2 U7.6 | v78.44,51.21 78.44,48.77 79.25,47.96 81.69,47.96 82.23,47.41 R18.1 84.06,44.5 v84.73,44.5 | v86.97,51.61 85.14,51.61
  Bottom 0.203: 78.19,51.45 v78.44,51.21 77.66,50.43 U5.3 | v84.73,44.5 87.58,44.5 88.39,45.31 88.39,51.21 87.99,51.61 v86.97,51.61
SIM1_DATA
  Top 0.203: U6.29 73.13,36.8 72.54,37.39 72.54,42.88 77.01,47.35 | 80.42,42.27 D3.4 77.01,45.68 77.01,47.35 | R21.2 82.23,56.96 81.89,57.3 77.83,57.3 77.01,56.49 77.01,53.6 | R24.2 80.33,50.28 77.01,53.6 | 77.01,47.35 77.01,53.6
SIM1_DATA_CONN  (via drill 0.36)
  Top 0.203: C27.2 92.25,52.49 v92.25,51.41 92.25,49.38 92.05,49.17 92.02,49.2 U7.3 | v84.12,49.38 R24.1
  Bottom 0.203: v92.25,51.41 89.41,48.56 89.41,45.11 87.58,43.28 84.12,43.28 83.52,43.89 83.52,48.77 v84.12,49.38 83.92,49.17 74.78,49.17 74.57,49.38 74.57,50.8 75.48,51.7 U5.7
SIM1_RST
  Top 0.203: D3.3 82.23,42.2 81.89,41.86 81.89,40.84 76.74,35.7 U6.28 72.81,35.7 71.53,36.98 71.53,43.08 76,47.55 76,56.9 77.22,58.12 82.5,58.12 83.92,56.69 83.92,54.46 82.23,52.77 R17.2
SIM1_RST_CONN  (via drill 0.36)
  Top 0.203: U7.7 85.55,47.23 | C24.2 85.55,44.03 85.55,47.23 | 85.55,47.23 85.55,48.97 83.72,50.8 81.08,50.8 80.33,51.55 R17.1 79.45,52.63 v78.44,53.64
  Bottom 0.203: U5.2 77.76,52.97 v78.44,53.64
SIM1_VDD  (via drill 0.36)
  Top 0.203: v78.44,56.49 79.25,55.68 R21.1 | U7.8 86.25,45.43 86.97,44.7 | 86.97,44.7 89.81,44.7 90.83,43.69 C25.1 89.75,43.01 88.8,42.06 88.8,40.64 87.99,39.83 83.76,39.83 D3.1 76.78,34.6 U6.27 | v87.17,45.52 86.97,45.31 86.97,44.7
  Bottom 0.203: v87.17,45.52 87.17,47.75 v78.44,56.49 78.39,56.53 77.38,55.51 U5.1
STM_PSM_EINT
  Top 0.203: U1.24 24.92,35.36 24.11,36.17 24.11,39.69 29.93,45.52 MODEMCTL.1
STM_PWRKEY
  Top 0.203: U1.25 25.4,35.86 24.78,36.49 24.78,39.64 28.11,42.98 MODEMCTL.3
STM_RESET
  Top 0.203: U1.27 25.81,36.86 25.4,37.26 25.4,39.42 28.05,42.06 33.68,42.06 MODEMCTL.5
STM_RX
  Top 0.203: U1.30 27.64,38.36 28.28,37.72 35.13,37.72 MODEMCTL.7
STM_TX
  Top 0.203: U1.29 27.4,37.86 29.3,35.97 34.7,35.97 MODEMCTL.9
USART1_RX  (via drill 0.36)
  Top 0.203: U1.43 19.53,40.66 v18.49,39.62
  Bottom 0.203: v18.49,39.62 16.87,41.25 16.87,49.17 20.1,52.41 20.1,60.59 USART1.2
USART1_TX  (via drill 0.36)
  Top 0.203: v19.71,39.62 20.03,39.94 U1.42
  Bottom 0.203: v19.71,39.62 19.51,39.62 17.68,41.45 17.68,48.36 21.16,51.84 21.16,59.11 USART1.3
USB_CONN_D_N
  Top 0.261: POWER.D- 87.65,31.71 86.47,32.89 85.55,32.89 84.83,32.17 U8.1
USB_CONN_D_P
  Top 0.261: POWER.D+ 87.65,32.36 86.66,33.35 85.55,33.35 84.83,34.07 U8.3
USB_D_N  (via drill 0.36)
  Top 0.261: U8.6 81.39,32.17 80.67,32.89 76.45,32.89 v76.2,32.64 | U1.44 19.04,41.37 19.04,42.69 20.75,44.4 20.75,48.46 18.99,50.22 11.07,50.22 6.33,54.96 6.33,58.22 7.62,59.51 12.29,59.51 12.83,60.05 12.83,60.94 CAN.3
  Bottom 0.261: CAN.3 12.83,63.01 12.83,63.51 13.1,63.78 67.37,63.78 68.65,62.49 68.65,35.87 71.63,32.89 75.95,32.89 v76.2,32.64
USB_D_P  (via drill 0.36)
  Top 0.261: R31.2 81.84,35.65 U8.4 81.39,34.07 80.67,33.35 76.45,33.35 v76.2,33.6 | CAN.2 12.37,60.94 12.37,60.24 12.1,59.97 7.42,59.97 5.86,58.41 5.86,54.77 10.88,49.76 18.8,49.76 20.29,48.27 20.29,44.6 18.53,42.83 U1.45
  Bottom 0.261: CAN.2 12.37,63.01 12.37,63.7 12.91,64.24 67.56,64.24 69.12,62.68 69.12,36.06 71.83,33.35 75.95,33.35 v76.2,33.6
V+  (via drill 0.36)
  Top 0.305: NET.A 42.64,17.71 43.18,17.17 50.5,17.17 54.5,13.17 R12.2
  Top 0.356: v57.51,6.35 57.51,10.57 56.29,11.79 54.54,11.79 R12.2
  Top 0.406: 52.43,6.37 U3.1 | C15.2 55.34,6.37 55.88,6.91
  Top 0.813: v72.14,54.86 74.37,54.86 74.78,54.46 74.78,53.85 | 74.78,53.85 D4.C | v72.14,54.86 69.29,54.86 68.82,54.39 C30.2 C32.2 C33.2 68.82,43.4 U6.34 U6.33 69.57,47.91 69.49,47.96 69.49,54.05 69.7,54.25 74.37,54.25 74.78,53.85 | v72.14,54.86 72.14,53.34 C19.+ | S1.3 88.2,12.99 88.19,12.4 v87.99,12.4
  Top 1.27: v57.51,6.35 57.48,6.38 57.2,6.38 57.19,6.37 C15.2 52.43,6.37
  Power 1.27: v57.51,6.35 84.58,6.35 87.99,9.75 v87.99,12.4
  Bottom 0.406: 85.22,29.16 U4.3
  Bottom 1.016: 85.22,29.16 85.22,28.65 83.6,27.03 82.8,27.03
  Bottom 1.27: v70.1,54.86 v71.12,54.86 v72.14,54.86 | v72.14,54.86 v73.56,54.86 73.97,54.46 | v87.99,12.4 87.17,12.4 85.95,13.61 85.95,20.71 82.8,23.86 L2.P$1 82.8,27.03 82.8,28.82 C20.2 R14.1 78.56,30.34 77.66,31.25 77.66,39.24 73,43.9 73,54 v72.14,54.86
VBUS  (via drill 0.36)
  Top 0.305: CHG.A v41.05,15.04
  Top 0.406: 81.69,25.6 F1.1 83.11,27.24 83.11,32.72 82.7,33.12 U8.5 | 82.72,6.78 82.77,6.78
  Top 1.27: U2.4 C14.2 82.72,6.78 v83.72,7.57 83.72,11.87 81.47,14.12 F1.1
  Top 2.032: F1.1 v79.65,25.6
  Power 0.305: v41.05,15.04 39.42,13.41 39.42,5.69 41.05,4.06 50.95,4.06 POWER-PINS.4
  Power 1.27: POWER-PINS.4 53.8,4.47 v75.79,4.47
  Power 2.032: v79.65,25.6 74.37,25.6 63.4,36.58 52.83,36.58 44.09,45.31 44.09,49.58 35.97,57.71 | USART1.4 26.57,58.98 27.84,57.71 35.97,57.71 | POWER-PINS1.4 67.21,59.08 65.84,57.71 35.97,57.71
  Bottom 1.27: 83.56,7.52 83.52,7.47 v83.72,7.57 83.72,6.3 83.28,5.91 82.45,5.08 76.4,5.08 v75.79,4.47
VDD  (via drill 0.36)
  Top 0.305: C2.2 26.33,26.82 L1.1 27.29,26.91 27.31,26.92 v27.31,26.9 | C2.2 C3.2 v24.99,24.18 | 23.57,26.96 C2.2 | U1.13 23.03,28.85 23.71,28.17 C2.2
VIN  (via drill 0.36)
  Top 0.203: 88.57,30.9 POWER.VBUS
  Top 0.813: 87.38,30.89 88.35,30.89 88.57,30.9
  Top 1.016: F1.2 85.56,30.29 86.16,30.89 87.38,30.89
  Top 2.032: F1.2 85.56,23.48 85.55,23.47 v85.55,23.23 v85.55,23.22
  Power 2.032: v85.55,23.22 85.55,21.34 84.33,20.12 v83.92,20.12
  Bottom 2.032: v83.92,20.12 82.18,20.12 U$1.PWR2

### Text on the board
tPlace: added new components. update BoM | CAN | UART1 | SPI1 | SPI2 | DIGITAL I/O | IDEABOARD V2.0 | DIGITAL I/O | B0 | B1 | BOOT MODE | X | 0 | MAIN FLASH | 0 | 1 | SYSTEM MEMORY | 1 | 1 | EMBEDDED SRAM | I2C 1 | ADC12 IN
bPlace: INSERT MICRO SIMCARD | 9088 / 4007 / 7733 / 3295 | Dialog IoT Device Information | BRAND | 5V STEP UP CONVERTER / SOLDER IF NEEDED | TYPE | STM32F103RBT6 | Quectel BC92 | VERSION | MAC | MSISDN
tNames: add more vias | GND | TX | RX | 3V3 | GND | RXD | TXD | VBUS | 3V3 | SCK | MISO | MOSI | NSS | GND | GND | NSS | MOSI | MISO | SCK | 3V3 | GND | 3V3 | 5V | VBUS | 3V3 | C9 | CC1101 | C8 | C7 | C6 | PWRKEY | GND | EINT | USR | PKEY | SWD | SWDIO | RST | GND | <<RXD | SWCLK | 3V3 | MODEM CON | 0 | 1 | RESET | B1 | NRST | 0 | 1 | BOOT MODE | B0 | POWER | SWO | A8 | C12 | NRST | B5 | QUECTEL BC92 | C11 | USER | OFF | B6 | A3 | ON | A2 | LIPO | NRST | BC92 DEBUG | JP1 | GND | SCL | SDA | 3V3 | C0 | C1 | C3 | B0 | A1 | A0 | GND | 3V3 | 5V | VBUS | GND | RXD | TXD
bNames: 5V INPUT
bStop: 2020/11/06